# Altium project KeyBoard.PrjPcb
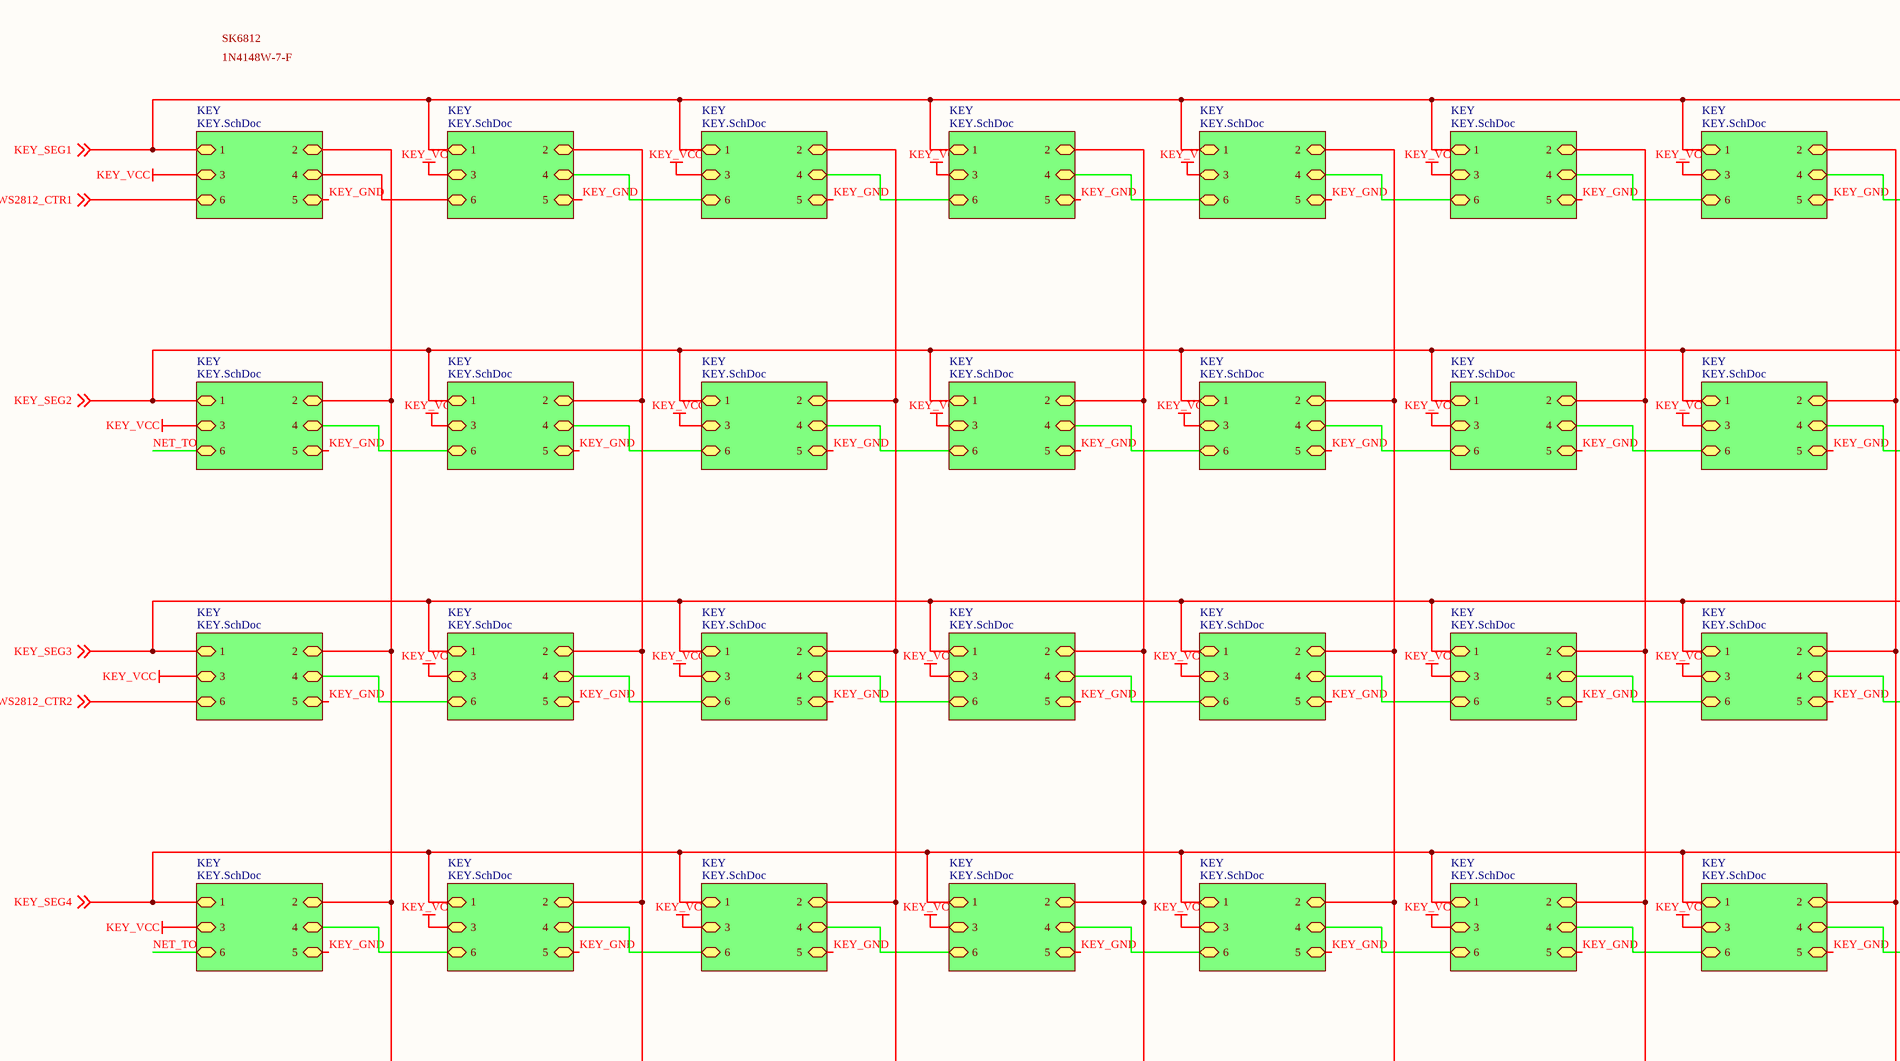
[diagram p0: keyboard.SchDoc, top left]
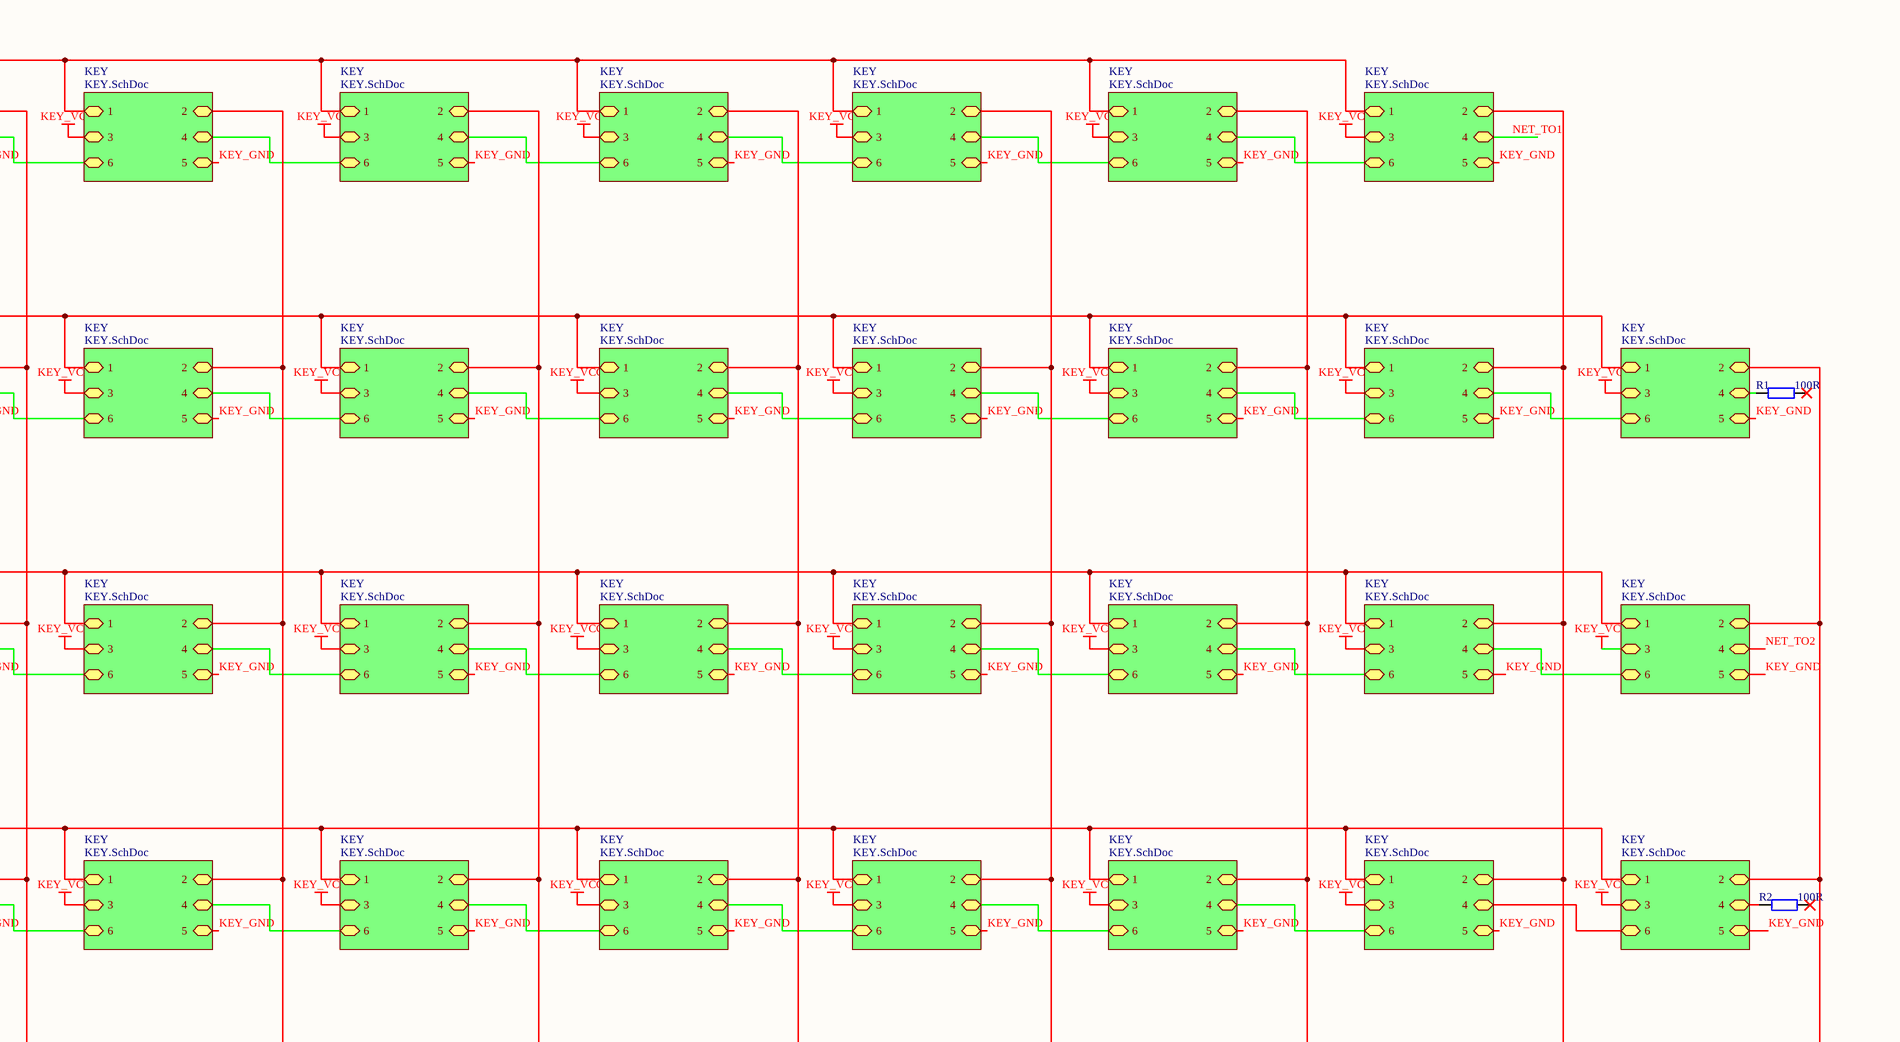
[diagram p1: keyboard.SchDoc, top right]
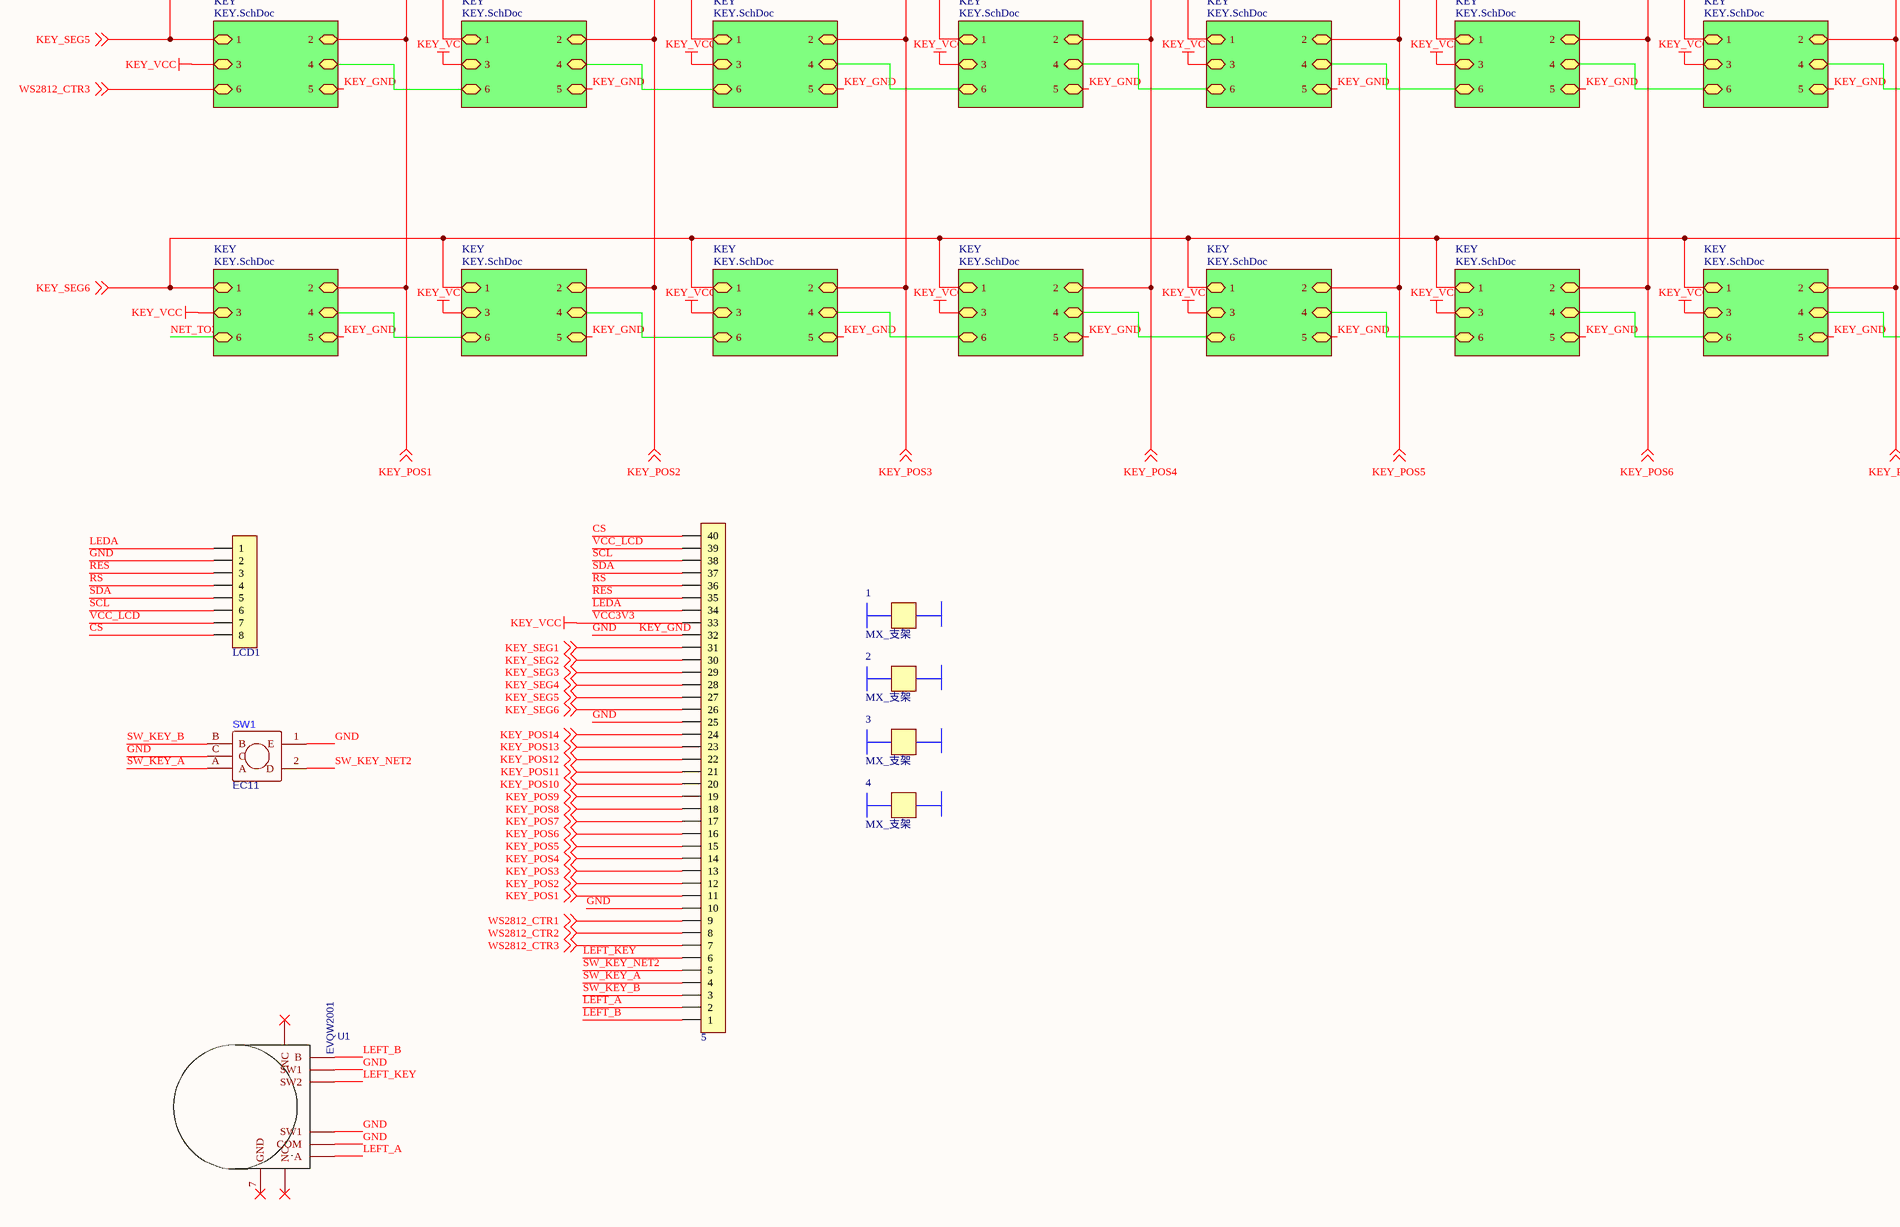
[diagram p2: keyboard.SchDoc, bottom left]
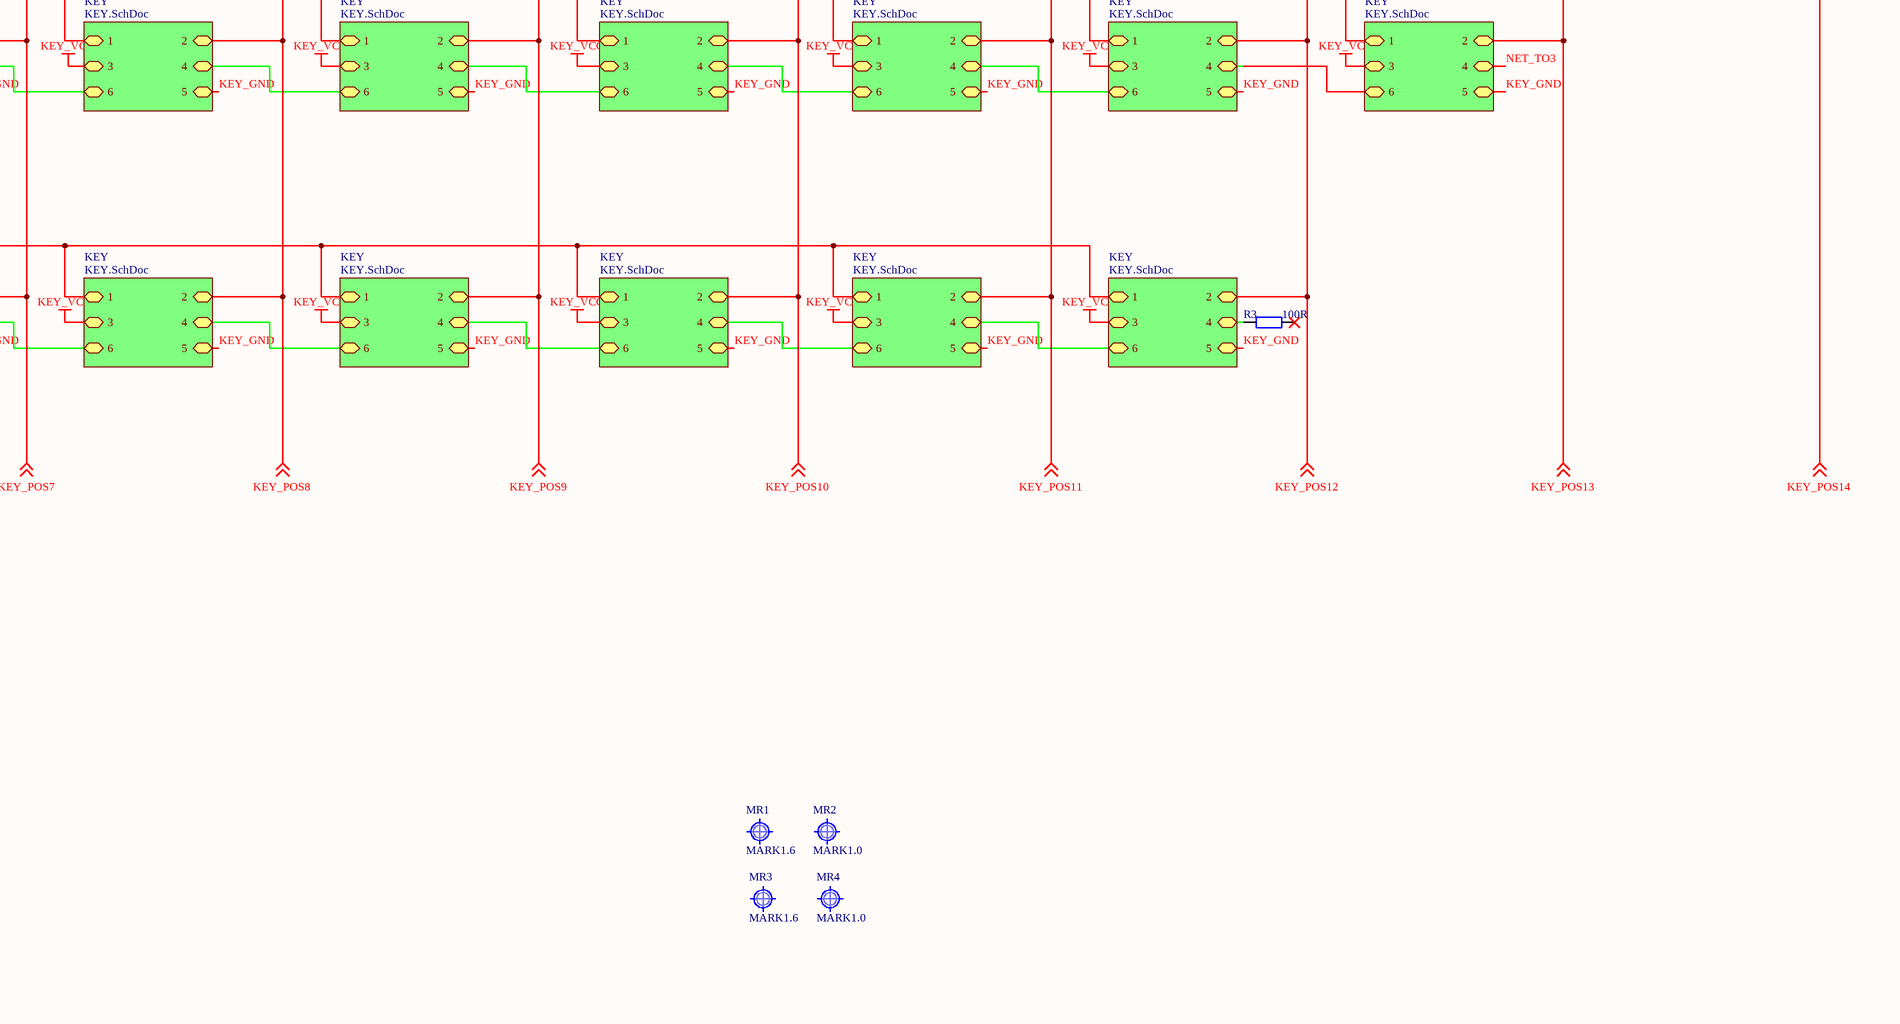
[diagram p3: keyboard.SchDoc, bottom right]
2 sheets, 335 parts. Net scope: hierarchical (ports join the sheet entries above them; power ports are global).
Board file: keyboard.PcbDoc
Sheets:
  keyboard.SchDoc
    KEY = KEY.SchDoc
    KEY = KEY.SchDoc
    KEY = KEY.SchDoc
    KEY = KEY.SchDoc
    KEY = KEY.SchDoc
    KEY = KEY.SchDoc
    KEY = KEY.SchDoc
    KEY = KEY.SchDoc
    KEY = KEY.SchDoc
    KEY = KEY.SchDoc
    KEY = KEY.SchDoc
    KEY = KEY.SchDoc
    KEY = KEY.SchDoc
    KEY = KEY.SchDoc
    KEY = KEY.SchDoc
    KEY = KEY.SchDoc
    KEY = KEY.SchDoc
    KEY = KEY.SchDoc
    KEY = KEY.SchDoc
    KEY = KEY.SchDoc
    KEY = KEY.SchDoc
    KEY = KEY.SchDoc
    KEY = KEY.SchDoc
    KEY = KEY.SchDoc
    KEY = KEY.SchDoc
    KEY = KEY.SchDoc
    KEY = KEY.SchDoc
    KEY = KEY.SchDoc
    KEY = KEY.SchDoc
    KEY = KEY.SchDoc
    KEY = KEY.SchDoc
    KEY = KEY.SchDoc
    KEY = KEY.SchDoc
    KEY = KEY.SchDoc
    KEY = KEY.SchDoc
    KEY = KEY.SchDoc
    KEY = KEY.SchDoc
    KEY = KEY.SchDoc
    KEY = KEY.SchDoc
    KEY = KEY.SchDoc
    KEY = KEY.SchDoc
    KEY = KEY.SchDoc
    KEY = KEY.SchDoc
    KEY = KEY.SchDoc
    KEY = KEY.SchDoc
    KEY = KEY.SchDoc
    KEY = KEY.SchDoc
    KEY = KEY.SchDoc
    KEY = KEY.SchDoc
    KEY = KEY.SchDoc
    KEY = KEY.SchDoc
    KEY = KEY.SchDoc
    KEY = KEY.SchDoc
    KEY = KEY.SchDoc
    KEY = KEY.SchDoc
    KEY = KEY.SchDoc
    KEY = KEY.SchDoc
    KEY = KEY.SchDoc
    KEY = KEY.SchDoc
    KEY = KEY.SchDoc
    KEY = KEY.SchDoc
    KEY = KEY.SchDoc
    KEY = KEY.SchDoc
    KEY = KEY.SchDoc
    KEY = KEY.SchDoc
    KEY = KEY.SchDoc
    KEY = KEY.SchDoc
    KEY = KEY.SchDoc
    KEY = KEY.SchDoc
    KEY = KEY.SchDoc
    KEY = KEY.SchDoc
    KEY = KEY.SchDoc
    KEY = KEY.SchDoc
    KEY = KEY.SchDoc
    KEY = KEY.SchDoc
    KEY = KEY.SchDoc
    KEY = KEY.SchDoc
    KEY = KEY.SchDoc
    KEY = KEY.SchDoc
    KEY = KEY.SchDoc

## Sheet keyboard.SchDoc
size A1

### Parts
1  MX_支架  [1x2]
2  MX_支架  [1x2]
3  MX_支架  [1x2]
4  MX_支架  [1x2]
5  FPC1.0-40P  [FPC0.5 2H-WS-40P]  (value not drawn)
LCD1  FPC1.0-8P  [FPC0.5 2H-WS-8P]  (value not drawn)
MR1  MARK1.6  [Mark 1.6]
MR2  MARK1.0  [Mark 1]
MR3  MARK1.6  [Mark 1.6]
MR4  MARK1.0  [Mark 1]
R1  100R  [R 0805_M]
R2  100R  [R 0805_M]
R3  100R  [R 0805_M]
SW1  EC11  [BOURNS_PEC11R-4XXXF-SXXXX]
U1  EVQW2001  [EVQWK2001 - duplicate]

### Sub-sheets
KEY = KEY.SchDoc: 2 (bidir), 3 (bidir), 5 (bidir), 4 (bidir), 6 (bidir), 1 (bidir)
KEY = KEY.SchDoc: 2 (bidir), 3 (bidir), 5 (bidir), 4 (bidir), 6 (bidir), 1 (bidir)
KEY = KEY.SchDoc: 2 (bidir), 3 (bidir), 5 (bidir), 4 (bidir), 6 (bidir), 1 (bidir)
KEY = KEY.SchDoc: 2 (bidir), 3 (bidir), 5 (bidir), 4 (bidir), 6 (bidir), 1 (bidir)
KEY = KEY.SchDoc: 2 (bidir), 3 (bidir), 5 (bidir), 4 (bidir), 6 (bidir), 1 (bidir)
KEY = KEY.SchDoc: 2 (bidir), 3 (bidir), 5 (bidir), 4 (bidir), 6 (bidir), 1 (bidir)
KEY = KEY.SchDoc: 2 (bidir), 3 (bidir), 5 (bidir), 4 (bidir), 6 (bidir), 1 (bidir)
KEY = KEY.SchDoc: 2 (bidir), 3 (bidir), 5 (bidir), 4 (bidir), 6 (bidir), 1 (bidir)
KEY = KEY.SchDoc: 2 (bidir), 3 (bidir), 5 (bidir), 4 (bidir), 6 (bidir), 1 (bidir)
KEY = KEY.SchDoc: 2 (bidir), 3 (bidir), 5 (bidir), 4 (bidir), 6 (bidir), 1 (bidir)
KEY = KEY.SchDoc: 2 (bidir), 3 (bidir), 5 (bidir), 4 (bidir), 6 (bidir), 1 (bidir)
KEY = KEY.SchDoc: 2 (bidir), 3 (bidir), 5 (bidir), 4 (bidir), 6 (bidir), 1 (bidir)
KEY = KEY.SchDoc: 2 (bidir), 3 (bidir), 5 (bidir), 4 (bidir), 6 (bidir), 1 (bidir)
KEY = KEY.SchDoc: 2 (bidir), 3 (bidir), 5 (bidir), 4 (bidir), 6 (bidir), 1 (bidir)
KEY = KEY.SchDoc: 2 (bidir), 3 (bidir), 5 (bidir), 4 (bidir), 6 (bidir), 1 (bidir)
KEY = KEY.SchDoc: 2 (bidir), 3 (bidir), 5 (bidir), 4 (bidir), 6 (bidir), 1 (bidir)
KEY = KEY.SchDoc: 2 (bidir), 3 (bidir), 5 (bidir), 4 (bidir), 6 (bidir), 1 (bidir)
KEY = KEY.SchDoc: 2 (bidir), 3 (bidir), 5 (bidir), 4 (bidir), 6 (bidir), 1 (bidir)
KEY = KEY.SchDoc: 2 (bidir), 3 (bidir), 5 (bidir), 4 (bidir), 6 (bidir), 1 (bidir)
KEY = KEY.SchDoc: 2 (bidir), 3 (bidir), 5 (bidir), 4 (bidir), 6 (bidir), 1 (bidir)
KEY = KEY.SchDoc: 2 (bidir), 3 (bidir), 5 (bidir), 4 (bidir), 6 (bidir), 1 (bidir)
KEY = KEY.SchDoc: 2 (bidir), 3 (bidir), 5 (bidir), 4 (bidir), 6 (bidir), 1 (bidir)
KEY = KEY.SchDoc: 2 (bidir), 3 (bidir), 5 (bidir), 4 (bidir), 6 (bidir), 1 (bidir)
KEY = KEY.SchDoc: 2 (bidir), 3 (bidir), 5 (bidir), 4 (bidir), 6 (bidir), 1 (bidir)
KEY = KEY.SchDoc: 2 (bidir), 3 (bidir), 5 (bidir), 4 (bidir), 6 (bidir), 1 (bidir)
KEY = KEY.SchDoc: 2 (bidir), 3 (bidir), 5 (bidir), 4 (bidir), 6 (bidir), 1 (bidir)
KEY = KEY.SchDoc: 2 (bidir), 3 (bidir), 5 (bidir), 4 (bidir), 6 (bidir), 1 (bidir)
KEY = KEY.SchDoc: 2 (bidir), 3 (bidir), 5 (bidir), 4 (bidir), 6 (bidir), 1 (bidir)
KEY = KEY.SchDoc: 2 (bidir), 3 (bidir), 5 (bidir), 4 (bidir), 6 (bidir), 1 (bidir)
KEY = KEY.SchDoc: 2 (bidir), 3 (bidir), 5 (bidir), 4 (bidir), 6 (bidir), 1 (bidir)
KEY = KEY.SchDoc: 2 (bidir), 3 (bidir), 5 (bidir), 4 (bidir), 6 (bidir), 1 (bidir)
KEY = KEY.SchDoc: 2 (bidir), 3 (bidir), 5 (bidir), 4 (bidir), 6 (bidir), 1 (bidir)
KEY = KEY.SchDoc: 2 (bidir), 3 (bidir), 5 (bidir), 4 (bidir), 6 (bidir), 1 (bidir)
KEY = KEY.SchDoc: 2 (bidir), 3 (bidir), 5 (bidir), 4 (bidir), 6 (bidir), 1 (bidir)
KEY = KEY.SchDoc: 2 (bidir), 3 (bidir), 5 (bidir), 4 (bidir), 6 (bidir), 1 (bidir)
KEY = KEY.SchDoc: 2 (bidir), 3 (bidir), 5 (bidir), 4 (bidir), 6 (bidir), 1 (bidir)
KEY = KEY.SchDoc: 2 (bidir), 3 (bidir), 5 (bidir), 4 (bidir), 6 (bidir), 1 (bidir)
KEY = KEY.SchDoc: 2 (bidir), 3 (bidir), 5 (bidir), 4 (bidir), 6 (bidir), 1 (bidir)
KEY = KEY.SchDoc: 2 (bidir), 3 (bidir), 5 (bidir), 4 (bidir), 6 (bidir), 1 (bidir)
KEY = KEY.SchDoc: 2 (bidir), 3 (bidir), 5 (bidir), 4 (bidir), 6 (bidir), 1 (bidir)
KEY = KEY.SchDoc: 2 (bidir), 3 (bidir), 5 (bidir), 4 (bidir), 6 (bidir), 1 (bidir)
KEY = KEY.SchDoc: 2 (bidir), 3 (bidir), 5 (bidir), 4 (bidir), 6 (bidir), 1 (bidir)
KEY = KEY.SchDoc: 2 (bidir), 3 (bidir), 5 (bidir), 4 (bidir), 6 (bidir), 1 (bidir)
KEY = KEY.SchDoc: 2 (bidir), 3 (bidir), 5 (bidir), 4 (bidir), 6 (bidir), 1 (bidir)
KEY = KEY.SchDoc: 2 (bidir), 3 (bidir), 5 (bidir), 4 (bidir), 6 (bidir), 1 (bidir)
KEY = KEY.SchDoc: 2 (bidir), 3 (bidir), 5 (bidir), 4 (bidir), 6 (bidir), 1 (bidir)
KEY = KEY.SchDoc: 2 (bidir), 3 (bidir), 5 (bidir), 4 (bidir), 6 (bidir), 1 (bidir)
KEY = KEY.SchDoc: 2 (bidir), 3 (bidir), 5 (bidir), 4 (bidir), 6 (bidir), 1 (bidir)
KEY = KEY.SchDoc: 2 (bidir), 3 (bidir), 5 (bidir), 4 (bidir), 6 (bidir), 1 (bidir)
KEY = KEY.SchDoc: 2 (bidir), 3 (bidir), 5 (bidir), 4 (bidir), 6 (bidir), 1 (bidir)
KEY = KEY.SchDoc: 2 (bidir), 3 (bidir), 5 (bidir), 4 (bidir), 6 (bidir), 1 (bidir)
KEY = KEY.SchDoc: 2 (bidir), 3 (bidir), 5 (bidir), 4 (bidir), 6 (bidir), 1 (bidir)
KEY = KEY.SchDoc: 2 (bidir), 3 (bidir), 5 (bidir), 4 (bidir), 6 (bidir), 1 (bidir)
KEY = KEY.SchDoc: 2 (bidir), 3 (bidir), 5 (bidir), 4 (bidir), 6 (bidir), 1 (bidir)
KEY = KEY.SchDoc: 2 (bidir), 3 (bidir), 5 (bidir), 4 (bidir), 6 (bidir), 1 (bidir)
KEY = KEY.SchDoc: 2 (bidir), 3 (bidir), 5 (bidir), 4 (bidir), 6 (bidir), 1 (bidir)
KEY = KEY.SchDoc: 2 (bidir), 3 (bidir), 5 (bidir), 4 (bidir), 6 (bidir), 1 (bidir)
KEY = KEY.SchDoc: 2 (bidir), 3 (bidir), 5 (bidir), 4 (bidir), 6 (bidir), 1 (bidir)
KEY = KEY.SchDoc: 2 (bidir), 3 (bidir), 5 (bidir), 4 (bidir), 6 (bidir), 1 (bidir)
KEY = KEY.SchDoc: 2 (bidir), 3 (bidir), 5 (bidir), 4 (bidir), 6 (bidir), 1 (bidir)
KEY = KEY.SchDoc: 2 (bidir), 3 (bidir), 5 (bidir), 4 (bidir), 6 (bidir), 1 (bidir)
KEY = KEY.SchDoc: 2 (bidir), 3 (bidir), 5 (bidir), 4 (bidir), 6 (bidir), 1 (bidir)
KEY = KEY.SchDoc: 2 (bidir), 3 (bidir), 5 (bidir), 4 (bidir), 6 (bidir), 1 (bidir)
KEY = KEY.SchDoc: 2 (bidir), 3 (bidir), 5 (bidir), 4 (bidir), 6 (bidir), 1 (bidir)
KEY = KEY.SchDoc: 2 (bidir), 3 (bidir), 5 (bidir), 4 (bidir), 6 (bidir), 1 (bidir)
KEY = KEY.SchDoc: 2 (bidir), 3 (bidir), 5 (bidir), 4 (bidir), 6 (bidir), 1 (bidir)
KEY = KEY.SchDoc: 2 (bidir), 3 (bidir), 5 (bidir), 4 (bidir), 6 (bidir), 1 (bidir)
KEY = KEY.SchDoc: 2 (bidir), 3 (bidir), 5 (bidir), 4 (bidir), 6 (bidir), 1 (bidir)
KEY = KEY.SchDoc: 2 (bidir), 3 (bidir), 5 (bidir), 4 (bidir), 6 (bidir), 1 (bidir)
KEY = KEY.SchDoc: 2 (bidir), 3 (bidir), 5 (bidir), 4 (bidir), 6 (bidir), 1 (bidir)
KEY = KEY.SchDoc: 2 (bidir), 3 (bidir), 5 (bidir), 4 (bidir), 6 (bidir), 1 (bidir)
KEY = KEY.SchDoc: 2 (bidir), 3 (bidir), 5 (bidir), 4 (bidir), 6 (bidir), 1 (bidir)
KEY = KEY.SchDoc: 2 (bidir), 3 (bidir), 5 (bidir), 4 (bidir), 6 (bidir), 1 (bidir)
KEY = KEY.SchDoc: 2 (bidir), 3 (bidir), 5 (bidir), 4 (bidir), 6 (bidir), 1 (bidir)
KEY = KEY.SchDoc: 2 (bidir), 3 (bidir), 5 (bidir), 4 (bidir), 6 (bidir), 1 (bidir)
KEY = KEY.SchDoc: 2 (bidir), 3 (bidir), 5 (bidir), 4 (bidir), 6 (bidir), 1 (bidir)
KEY = KEY.SchDoc: 2 (bidir), 3 (bidir), 5 (bidir), 4 (bidir), 6 (bidir), 1 (bidir)
KEY = KEY.SchDoc: 2 (bidir), 3 (bidir), 5 (bidir), 4 (bidir), 6 (bidir), 1 (bidir)
KEY = KEY.SchDoc: 2 (bidir), 3 (bidir), 5 (bidir), 4 (bidir), 6 (bidir), 1 (bidir)
KEY = KEY.SchDoc: 2 (bidir), 3 (bidir), 5 (bidir), 4 (bidir), 6 (bidir), 1 (bidir)

### Nets
VCC3V3: 5.33 ; sheet KEY/3, sheet KEY/3, sheet KEY/3, sheet KEY/3, sheet KEY/3, sheet KEY/3, sheet KEY/3, sheet KEY/3, sheet KEY/3, sheet KEY/3, sheet KEY/3, sheet KEY/3, sheet KEY/3, sheet KEY/3, sheet KEY/3, sheet KEY/3, sheet KEY/3, sheet KEY/3, sheet KEY/3, sheet KEY/3, sheet KEY/3, sheet KEY/3, sheet KEY/3, sheet KEY/3, sheet KEY/3, sheet KEY/3, sheet KEY/3, sheet KEY/3, sheet KEY/3, sheet KEY/3, sheet KEY/3, sheet KEY/3, sheet KEY/3, sheet KEY/3, sheet KEY/3, sheet KEY/3, sheet KEY/3, sheet KEY/3, sheet KEY/3, sheet KEY/3, sheet KEY/3, sheet KEY/3, sheet KEY/3, sheet KEY/3, sheet KEY/3, sheet KEY/3, sheet KEY/3, sheet KEY/3, sheet KEY/3, sheet KEY/3, sheet KEY/3, sheet KEY/3, sheet KEY/3, sheet KEY/3, sheet KEY/3, sheet KEY/3, sheet KEY/3, sheet KEY/3, sheet KEY/3, sheet KEY/3, sheet KEY/3, sheet KEY/3, sheet KEY/3, sheet KEY/3, sheet KEY/3, sheet KEY/3, sheet KEY/3, sheet KEY/3, sheet KEY/3, sheet KEY/3, sheet KEY/3, sheet KEY/3, sheet KEY/3, sheet KEY/3, sheet KEY/3, sheet KEY/3, sheet KEY/3, sheet KEY/3, sheet KEY/3, sheet KEY/3  [also labelled KEY_VCC]
CS: 5.40 LCD1.8
GND: 5.10 5.25 5.32 LCD1.2 SW1.1(E) SW1.C U1.2(SW1) U1.4(SW1) U1.5(COM) ; sheet KEY/5, sheet KEY/5, sheet KEY/5, sheet KEY/5, sheet KEY/5, sheet KEY/5, sheet KEY/5, sheet KEY/5, sheet KEY/5, sheet KEY/5, sheet KEY/5, sheet KEY/5, sheet KEY/5, sheet KEY/5, sheet KEY/5, sheet KEY/5, sheet KEY/5, sheet KEY/5, sheet KEY/5, sheet KEY/5, sheet KEY/5, sheet KEY/5, sheet KEY/5, sheet KEY/5, sheet KEY/5, sheet KEY/5, sheet KEY/5, sheet KEY/5, sheet KEY/5, sheet KEY/5, sheet KEY/5, sheet KEY/5, sheet KEY/5, sheet KEY/5, sheet KEY/5, sheet KEY/5, sheet KEY/5, sheet KEY/5, sheet KEY/5, sheet KEY/5, sheet KEY/5, sheet KEY/5, sheet KEY/5, sheet KEY/5, sheet KEY/5, sheet KEY/5, sheet KEY/5, sheet KEY/5, sheet KEY/5, sheet KEY/5, sheet KEY/5, sheet KEY/5, sheet KEY/5, sheet KEY/5, sheet KEY/5, sheet KEY/5, sheet KEY/5, sheet KEY/5, sheet KEY/5, sheet KEY/5, sheet KEY/5, sheet KEY/5, sheet KEY/5, sheet KEY/5, sheet KEY/5, sheet KEY/5, sheet KEY/5, sheet KEY/5, sheet KEY/5, sheet KEY/5, sheet KEY/5, sheet KEY/5, sheet KEY/5, sheet KEY/5, sheet KEY/5, sheet KEY/5, sheet KEY/5, sheet KEY/5, sheet KEY/5, sheet KEY/5  [also labelled KEY_GND]
KEY_POS1: 5.11 ; off-sheet KEY_POS1, sheet KEY/2, sheet KEY/2, sheet KEY/2, sheet KEY/2, sheet KEY/2, sheet KEY/2
KEY_POS2: 5.12 ; off-sheet KEY_POS2, sheet KEY/2, sheet KEY/2, sheet KEY/2, sheet KEY/2, sheet KEY/2, sheet KEY/2
KEY_POS3: 5.13 ; off-sheet KEY_POS3, sheet KEY/2, sheet KEY/2, sheet KEY/2, sheet KEY/2, sheet KEY/2, sheet KEY/2
KEY_POS4: 5.14 ; off-sheet KEY_POS4, sheet KEY/2, sheet KEY/2, sheet KEY/2, sheet KEY/2, sheet KEY/2, sheet KEY/2
KEY_POS5: 5.15 ; off-sheet KEY_POS5, sheet KEY/2, sheet KEY/2, sheet KEY/2, sheet KEY/2, sheet KEY/2, sheet KEY/2
KEY_POS6: 5.16 ; off-sheet KEY_POS6, sheet KEY/2, sheet KEY/2, sheet KEY/2, sheet KEY/2, sheet KEY/2, sheet KEY/2
KEY_POS7: 5.17 ; off-sheet KEY_POS7, sheet KEY/2, sheet KEY/2, sheet KEY/2, sheet KEY/2, sheet KEY/2, sheet KEY/2
KEY_POS8: 5.18 ; off-sheet KEY_POS8, sheet KEY/2, sheet KEY/2, sheet KEY/2, sheet KEY/2, sheet KEY/2, sheet KEY/2
KEY_POS9: 5.19 ; off-sheet KEY_POS9, sheet KEY/2, sheet KEY/2, sheet KEY/2, sheet KEY/2, sheet KEY/2, sheet KEY/2
KEY_POS10: 5.20 ; off-sheet KEY_POS10, sheet KEY/2, sheet KEY/2, sheet KEY/2, sheet KEY/2, sheet KEY/2, sheet KEY/2
KEY_POS11: 5.21 ; off-sheet KEY_POS11, sheet KEY/2, sheet KEY/2, sheet KEY/2, sheet KEY/2, sheet KEY/2, sheet KEY/2
KEY_POS12: 5.22 ; off-sheet KEY_POS12, sheet KEY/2, sheet KEY/2, sheet KEY/2, sheet KEY/2, sheet KEY/2, sheet KEY/2
KEY_POS13: 5.23 ; off-sheet KEY_POS13, sheet KEY/2, sheet KEY/2, sheet KEY/2, sheet KEY/2, sheet KEY/2
KEY_POS14: 5.24 ; off-sheet KEY_POS14, sheet KEY/2, sheet KEY/2, sheet KEY/2
KEY_SEG1: 5.31 ; off-sheet KEY_SEG1, sheet KEY/1, sheet KEY/1, sheet KEY/1, sheet KEY/1, sheet KEY/1, sheet KEY/1, sheet KEY/1, sheet KEY/1, sheet KEY/1, sheet KEY/1, sheet KEY/1, sheet KEY/1, sheet KEY/1
KEY_SEG2: 5.30 ; off-sheet KEY_SEG2, sheet KEY/1, sheet KEY/1, sheet KEY/1, sheet KEY/1, sheet KEY/1, sheet KEY/1, sheet KEY/1, sheet KEY/1, sheet KEY/1, sheet KEY/1, sheet KEY/1, sheet KEY/1, sheet KEY/1, sheet KEY/1
KEY_SEG3: 5.29 ; off-sheet KEY_SEG3, sheet KEY/1, sheet KEY/1, sheet KEY/1, sheet KEY/1, sheet KEY/1, sheet KEY/1, sheet KEY/1, sheet KEY/1, sheet KEY/1, sheet KEY/1, sheet KEY/1, sheet KEY/1, sheet KEY/1, sheet KEY/1
KEY_SEG4: 5.28 ; off-sheet KEY_SEG4, sheet KEY/1, sheet KEY/1, sheet KEY/1, sheet KEY/1, sheet KEY/1, sheet KEY/1, sheet KEY/1, sheet KEY/1, sheet KEY/1, sheet KEY/1, sheet KEY/1, sheet KEY/1, sheet KEY/1, sheet KEY/1
KEY_SEG5: 5.27 ; off-sheet KEY_SEG5, sheet KEY/1, sheet KEY/1, sheet KEY/1, sheet KEY/1, sheet KEY/1, sheet KEY/1, sheet KEY/1, sheet KEY/1, sheet KEY/1, sheet KEY/1, sheet KEY/1, sheet KEY/1, sheet KEY/1
KEY_SEG6: 5.26 ; off-sheet KEY_SEG6, sheet KEY/1, sheet KEY/1, sheet KEY/1, sheet KEY/1, sheet KEY/1, sheet KEY/1, sheet KEY/1, sheet KEY/1, sheet KEY/1, sheet KEY/1, sheet KEY/1, sheet KEY/1
LEDA: 5.34 LCD1.1
LEFT_A: 5.2 U1.6(A)
LEFT_B: 5.1 U1.1(B)
LEFT_KEY: 5.6 U1.3(SW2)
NET_TO1: sheet KEY/4, sheet KEY/6
NET_TO2: sheet KEY/4, sheet KEY/6
NET_TO3: sheet KEY/4, sheet KEY/6
RES: 5.35 LCD1.3
RS: 5.36 LCD1.4
SCL: 5.38 LCD1.6
SDA: 5.37 LCD1.5
SW_KEY_A: 5.4 SW1.A
SW_KEY_B: 5.3 SW1.B
SW_KEY_NET2: 5.5 SW1.2(D)
VCC_LCD: 5.39 LCD1.7
WS2812_CTR1: 5.9 ; off-sheet WS2812_CTR1, sheet KEY/6
WS2812_CTR2: 5.8 ; off-sheet WS2812_CTR2, sheet KEY/6
WS2812_CTR3: 5.7 ; off-sheet WS2812_CTR3, sheet KEY/6
NetR1_1: R1.1 ; sheet KEY/4
NetR2_1: R2.1 ; sheet KEY/4
NetR3_1: R3.1 ; sheet KEY/4
NetRGB1_KEY#1_4: sheet KEY/4, sheet KEY/6
NetRGB1_KEY#1_6: sheet KEY/6, sheet KEY/4
NetRGB1_KEY#2_4: sheet KEY/4, sheet KEY/6
NetRGB1_KEY#4_4: sheet KEY/4, sheet KEY/6
NetRGB1_KEY#5_4: sheet KEY/4, sheet KEY/6
NetRGB1_KEY#6_4: sheet KEY/4, sheet KEY/6
NetRGB1_KEY#7_4: sheet KEY/4, sheet KEY/6
NetRGB1_KEY#8_4: sheet KEY/4, sheet KEY/6
NetRGB1_KEY#9_4: sheet KEY/4, sheet KEY/6
NetRGB1_KEY#10_4: sheet KEY/4, sheet KEY/6
NetRGB1_KEY#11_4: sheet KEY/4, sheet KEY/6
NetRGB1_KEY#12_4: sheet KEY/4, sheet KEY/6
NetRGB1_KEY#14_4: sheet KEY/4, sheet KEY/6
NetRGB1_KEY#15_4: sheet KEY/4, sheet KEY/6
NetRGB1_KEY#16_4: sheet KEY/4, sheet KEY/6
NetRGB1_KEY#17_4: sheet KEY/4, sheet KEY/6
NetRGB1_KEY#18_4: sheet KEY/4, sheet KEY/6
NetRGB1_KEY#19_4: sheet KEY/4, sheet KEY/6
NetRGB1_KEY#20_4: sheet KEY/4, sheet KEY/6
NetRGB1_KEY#21_4: sheet KEY/4, sheet KEY/6
NetRGB1_KEY#22_4: sheet KEY/4, sheet KEY/6
NetRGB1_KEY#23_4: sheet KEY/4, sheet KEY/6
NetRGB1_KEY#24_4: sheet KEY/4, sheet KEY/6
NetRGB1_KEY#25_4: sheet KEY/4, sheet KEY/6
NetRGB1_KEY#26_4: sheet KEY/4, sheet KEY/6
NetRGB1_KEY#28_4: sheet KEY/4, sheet KEY/6
NetRGB1_KEY#29_4: sheet KEY/4, sheet KEY/6
NetRGB1_KEY#30_4: sheet KEY/4, sheet KEY/6
NetRGB1_KEY#31_4: sheet KEY/4, sheet KEY/6
NetRGB1_KEY#32_4: sheet KEY/4, sheet KEY/6
NetRGB1_KEY#33_4: sheet KEY/4, sheet KEY/6
NetRGB1_KEY#34_4: sheet KEY/4, sheet KEY/6
NetRGB1_KEY#35_4: sheet KEY/4, sheet KEY/6
NetRGB1_KEY#36_4: sheet KEY/4, sheet KEY/6
NetRGB1_KEY#37_4: sheet KEY/4, sheet KEY/6
NetRGB1_KEY#38_4: sheet KEY/4, sheet KEY/6
NetRGB1_KEY#39_4: sheet KEY/4, sheet KEY/6
NetRGB1_KEY#40_4: sheet KEY/4, sheet KEY/6
NetRGB1_KEY#42_4: sheet KEY/4, sheet KEY/6
NetRGB1_KEY#43_4: sheet KEY/4, sheet KEY/6
NetRGB1_KEY#44_4: sheet KEY/4, sheet KEY/6
NetRGB1_KEY#45_4: sheet KEY/4, sheet KEY/6
NetRGB1_KEY#46_4: sheet KEY/4, sheet KEY/6
NetRGB1_KEY#47_4: sheet KEY/4, sheet KEY/6
NetRGB1_KEY#48_4: sheet KEY/4, sheet KEY/6
NetRGB1_KEY#49_4: sheet KEY/4, sheet KEY/6
NetRGB1_KEY#50_4: sheet KEY/4, sheet KEY/6
NetRGB1_KEY#51_4: sheet KEY/4, sheet KEY/6
NetRGB1_KEY#52_4: sheet KEY/4, sheet KEY/6
NetRGB1_KEY#53_4: sheet KEY/4, sheet KEY/6
NetRGB1_KEY#54_4: sheet KEY/4, sheet KEY/6
NetRGB1_KEY#56_4: sheet KEY/4, sheet KEY/6
NetRGB1_KEY#57_4: sheet KEY/4, sheet KEY/6
NetRGB1_KEY#58_4: sheet KEY/4, sheet KEY/6
NetRGB1_KEY#59_4: sheet KEY/4, sheet KEY/6
NetRGB1_KEY#60_4: sheet KEY/4, sheet KEY/6
NetRGB1_KEY#61_4: sheet KEY/4, sheet KEY/6
NetRGB1_KEY#62_4: sheet KEY/4, sheet KEY/6
NetRGB1_KEY#63_4: sheet KEY/4, sheet KEY/6
NetRGB1_KEY#64_4: sheet KEY/4, sheet KEY/6
NetRGB1_KEY#65_4: sheet KEY/4, sheet KEY/6
NetRGB1_KEY#66_4: sheet KEY/4, sheet KEY/6
NetRGB1_KEY#67_4: sheet KEY/4, sheet KEY/6
NetRGB1_KEY#69_4: sheet KEY/4, sheet KEY/6
NetRGB1_KEY#70_4: sheet KEY/4, sheet KEY/6
NetRGB1_KEY#71_4: sheet KEY/4, sheet KEY/6
NetRGB1_KEY#72_4: sheet KEY/4, sheet KEY/6
NetRGB1_KEY#73_4: sheet KEY/4, sheet KEY/6
NetRGB1_KEY#74_4: sheet KEY/4, sheet KEY/6
NetRGB1_KEY#75_4: sheet KEY/4, sheet KEY/6
NetRGB1_KEY#76_4: sheet KEY/4, sheet KEY/6
NetRGB1_KEY#77_4: sheet KEY/4, sheet KEY/6
NetRGB1_KEY#78_4: sheet KEY/4, sheet KEY/6
NetRGB1_KEY#79_4: sheet KEY/4, sheet KEY/6

Not connected (* = marked no-connect by the designer): R1 2*; R2 2*; R3 2*; U1 7(GND)* 8(NC)*

### Notes on the sheet
- SK6812
- 1N4148W-7-F
- Title
- Size:
- Date:
- File:
- A1
- Number:
- Time:
- Revision:
- Sheet
- of

### Library data of the parts
5 = FPC-40P: FPC连接器; 版权归属: 黎明电子style; BOM名称: FPC连接器; 学习资源: https://lmdzstyle.taobao.com/
LCD1 = FPC-8P: FPC连接器; 版权归属: 黎明电子style; BOM名称: FPC连接器; 学习资源: https://lmdzstyle.taobao.com/
MR1-MR4 = MARK: 光学定位点
R1-R3 = R: 贴片电阻
U1 = EVQW2001: Contributor: jam_dan; spicePre: U; spiceSymbolName: EVQW2001

## Sheet KEY.SchDoc
size A4
Used 80 times, as channels KEY, KEY, KEY, KEY, KEY, KEY, KEY, KEY, KEY, KEY, KEY, KEY, KEY, KEY, KEY, KEY, KEY, KEY, KEY, KEY, KEY, KEY, KEY, KEY, KEY, KEY, KEY, KEY, KEY, KEY, KEY, KEY, KEY, KEY, KEY, KEY, KEY, KEY, KEY, KEY, KEY, KEY, KEY, KEY, KEY, KEY, KEY, KEY, KEY, KEY, KEY, KEY, KEY, KEY, KEY, KEY, KEY, KEY, KEY, KEY, KEY, KEY, KEY, KEY, KEY, KEY, KEY, KEY, KEY, KEY, KEY, KEY, KEY, KEY, KEY, KEY, KEY, KEY, KEY, KEY. Parts and nets are listed once, with the designators drawn on the sheet.
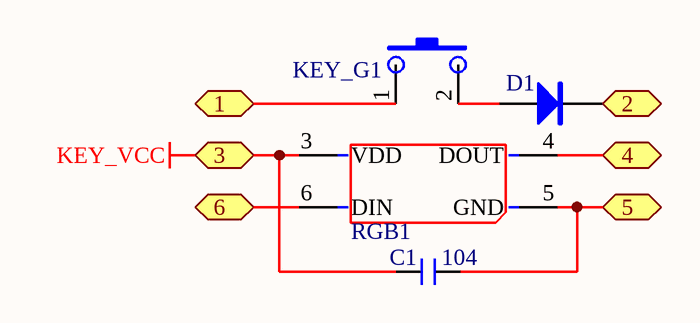
[diagram p4: KEY.SchDoc]

### Parts
C1  104  [0805]
D1  1N4148W-7-F  [SOD-123]  (value not drawn)
KEY_G1  KEY_G  [GATERON]  (value not drawn)
RGB1  RGB  [WS2812]  (value not drawn)

### Ports
1 (bidir), 2 (bidir), 3 (bidir), 4 (bidir), 5 (bidir), 6 (bidir)

### Nets
KEY_VCC: C1.1 RGB1.3(VDD) ; port 3
1: KEY_G1.1 ; port 1
2: D1.2(K) ; port 2
4: RGB1.4(DOUT) ; port 4
5: C1.2 RGB1.5(GND) ; port 5
6: RGB1.6(DIN) ; port 6
NetD1_1: D1.1(A) KEY_G1.2

### Channels
KEY: designators end in _KEY#1; ports 1=KEY_SEG1 2=KEY_POS2 3=VCC3V3 4=NetRGB1_KEY#1_4 5=GND 6=NetRGB1_KEY#1_6
KEY: designators end in _KEY#2; ports 1=KEY_SEG1 2=KEY_POS3 3=VCC3V3 4=NetRGB1_KEY#2_4 5=GND 6=NetRGB1_KEY#1_4
KEY: designators end in _KEY#3; ports 1=KEY_SEG1 2=KEY_POS1 3=VCC3V3 4=NetRGB1_KEY#1_6 5=GND 6=WS2812_CTR1
KEY: designators end in _KEY#4; ports 1=KEY_SEG1 2=KEY_POS4 3=VCC3V3 4=NetRGB1_KEY#4_4 5=GND 6=NetRGB1_KEY#2_4
KEY: designators end in _KEY#5; ports 1=KEY_SEG1 2=KEY_POS5 3=VCC3V3 4=NetRGB1_KEY#5_4 5=GND 6=NetRGB1_KEY#4_4
KEY: designators end in _KEY#6; ports 1=KEY_SEG1 2=KEY_POS6 3=VCC3V3 4=NetRGB1_KEY#6_4 5=GND 6=NetRGB1_KEY#5_4
KEY: designators end in _KEY#7; ports 1=KEY_SEG1 2=KEY_POS7 3=VCC3V3 4=NetRGB1_KEY#7_4 5=GND 6=NetRGB1_KEY#6_4
KEY: designators end in _KEY#8; ports 1=KEY_SEG1 2=KEY_POS8 3=VCC3V3 4=NetRGB1_KEY#8_4 5=GND 6=NetRGB1_KEY#7_4
KEY: designators end in _KEY#9; ports 1=KEY_SEG1 2=KEY_POS9 3=VCC3V3 4=NetRGB1_KEY#9_4 5=GND 6=NetRGB1_KEY#8_4
KEY: designators end in _KEY#10; ports 1=KEY_SEG1 2=KEY_POS10 3=VCC3V3 4=NetRGB1_KEY#10_4 5=GND 6=NetRGB1_KEY#9_4
KEY: designators end in _KEY#11; ports 1=KEY_SEG1 2=KEY_POS11 3=VCC3V3 4=NetRGB1_KEY#11_4 5=GND 6=NetRGB1_KEY#10_4
KEY: designators end in _KEY#12; ports 1=KEY_SEG1 2=KEY_POS12 3=VCC3V3 4=NetRGB1_KEY#12_4 5=GND 6=NetRGB1_KEY#11_4
KEY: designators end in _KEY#13; ports 1=KEY_SEG1 2=KEY_POS13 3=VCC3V3 4=NET_TO1 5=GND 6=NetRGB1_KEY#12_4
KEY: designators end in _KEY#14; ports 1=KEY_SEG2 2=KEY_POS1 3=VCC3V3 4=NetRGB1_KEY#14_4 5=GND 6=NET_TO1
KEY: designators end in _KEY#15; ports 1=KEY_SEG2 2=KEY_POS2 3=VCC3V3 4=NetRGB1_KEY#15_4 5=GND 6=NetRGB1_KEY#14_4
KEY: designators end in _KEY#16; ports 1=KEY_SEG2 2=KEY_POS3 3=VCC3V3 4=NetRGB1_KEY#16_4 5=GND 6=NetRGB1_KEY#15_4
KEY: designators end in _KEY#17; ports 1=KEY_SEG2 2=KEY_POS4 3=VCC3V3 4=NetRGB1_KEY#17_4 5=GND 6=NetRGB1_KEY#16_4
KEY: designators end in _KEY#18; ports 1=KEY_SEG2 2=KEY_POS5 3=VCC3V3 4=NetRGB1_KEY#18_4 5=GND 6=NetRGB1_KEY#17_4
KEY: designators end in _KEY#19; ports 1=KEY_SEG2 2=KEY_POS6 3=VCC3V3 4=NetRGB1_KEY#19_4 5=GND 6=NetRGB1_KEY#18_4
KEY: designators end in _KEY#20; ports 1=KEY_SEG2 2=KEY_POS7 3=VCC3V3 4=NetRGB1_KEY#20_4 5=GND 6=NetRGB1_KEY#19_4
KEY: designators end in _KEY#21; ports 1=KEY_SEG2 2=KEY_POS8 3=VCC3V3 4=NetRGB1_KEY#21_4 5=GND 6=NetRGB1_KEY#20_4
KEY: designators end in _KEY#22; ports 1=KEY_SEG2 2=KEY_POS9 3=VCC3V3 4=NetRGB1_KEY#22_4 5=GND 6=NetRGB1_KEY#21_4
KEY: designators end in _KEY#23; ports 1=KEY_SEG2 2=KEY_POS10 3=VCC3V3 4=NetRGB1_KEY#23_4 5=GND 6=NetRGB1_KEY#22_4
KEY: designators end in _KEY#24; ports 1=KEY_SEG2 2=KEY_POS11 3=VCC3V3 4=NetRGB1_KEY#24_4 5=GND 6=NetRGB1_KEY#23_4
KEY: designators end in _KEY#25; ports 1=KEY_SEG2 2=KEY_POS12 3=VCC3V3 4=NetRGB1_KEY#25_4 5=GND 6=NetRGB1_KEY#24_4
KEY: designators end in _KEY#26; ports 1=KEY_SEG2 2=KEY_POS13 3=VCC3V3 4=NetRGB1_KEY#26_4 5=GND 6=NetRGB1_KEY#25_4
KEY: designators end in _KEY#27; ports 1=KEY_SEG2 2=KEY_POS14 3=VCC3V3 4=NetR1_1 5=GND 6=NetRGB1_KEY#26_4
KEY: designators end in _KEY#28; ports 1=KEY_SEG3 2=KEY_POS1 3=VCC3V3 4=NetRGB1_KEY#28_4 5=GND 6=WS2812_CTR2
KEY: designators end in _KEY#29; ports 1=KEY_SEG3 2=KEY_POS2 3=VCC3V3 4=NetRGB1_KEY#29_4 5=GND 6=NetRGB1_KEY#28_4
KEY: designators end in _KEY#30; ports 1=KEY_SEG3 2=KEY_POS3 3=VCC3V3 4=NetRGB1_KEY#30_4 5=GND 6=NetRGB1_KEY#29_4
KEY: designators end in _KEY#31; ports 1=KEY_SEG3 2=KEY_POS4 3=VCC3V3 4=NetRGB1_KEY#31_4 5=GND 6=NetRGB1_KEY#30_4
KEY: designators end in _KEY#32; ports 1=KEY_SEG3 2=KEY_POS5 3=VCC3V3 4=NetRGB1_KEY#32_4 5=GND 6=NetRGB1_KEY#31_4
KEY: designators end in _KEY#33; ports 1=KEY_SEG3 2=KEY_POS6 3=VCC3V3 4=NetRGB1_KEY#33_4 5=GND 6=NetRGB1_KEY#32_4
KEY: designators end in _KEY#34; ports 1=KEY_SEG3 2=KEY_POS7 3=VCC3V3 4=NetRGB1_KEY#34_4 5=GND 6=NetRGB1_KEY#33_4
KEY: designators end in _KEY#35; ports 1=KEY_SEG3 2=KEY_POS8 3=VCC3V3 4=NetRGB1_KEY#35_4 5=GND 6=NetRGB1_KEY#34_4
KEY: designators end in _KEY#36; ports 1=KEY_SEG3 2=KEY_POS9 3=VCC3V3 4=NetRGB1_KEY#36_4 5=GND 6=NetRGB1_KEY#35_4
KEY: designators end in _KEY#37; ports 1=KEY_SEG3 2=KEY_POS10 3=VCC3V3 4=NetRGB1_KEY#37_4 5=GND 6=NetRGB1_KEY#36_4
KEY: designators end in _KEY#38; ports 1=KEY_SEG3 2=KEY_POS11 3=VCC3V3 4=NetRGB1_KEY#38_4 5=GND 6=NetRGB1_KEY#37_4
KEY: designators end in _KEY#39; ports 1=KEY_SEG3 2=KEY_POS12 3=VCC3V3 4=NetRGB1_KEY#39_4 5=GND 6=NetRGB1_KEY#38_4
KEY: designators end in _KEY#40; ports 1=KEY_SEG3 2=KEY_POS13 3=VCC3V3 4=NetRGB1_KEY#40_4 5=GND 6=NetRGB1_KEY#39_4
KEY: designators end in _KEY#41; ports 1=KEY_SEG3 2=KEY_POS14 3=VCC3V3 4=NET_TO2 5=GND 6=NetRGB1_KEY#40_4
KEY: designators end in _KEY#42; ports 1=KEY_SEG4 2=KEY_POS1 3=VCC3V3 4=NetRGB1_KEY#42_4 5=GND 6=NET_TO2
KEY: designators end in _KEY#43; ports 1=KEY_SEG4 2=KEY_POS2 3=VCC3V3 4=NetRGB1_KEY#43_4 5=GND 6=NetRGB1_KEY#42_4
KEY: designators end in _KEY#44; ports 1=KEY_SEG4 2=KEY_POS3 3=VCC3V3 4=NetRGB1_KEY#44_4 5=GND 6=NetRGB1_KEY#43_4
KEY: designators end in _KEY#45; ports 1=KEY_SEG4 2=KEY_POS4 3=VCC3V3 4=NetRGB1_KEY#45_4 5=GND 6=NetRGB1_KEY#44_4
KEY: designators end in _KEY#46; ports 1=KEY_SEG4 2=KEY_POS5 3=VCC3V3 4=NetRGB1_KEY#46_4 5=GND 6=NetRGB1_KEY#45_4
KEY: designators end in _KEY#47; ports 1=KEY_SEG4 2=KEY_POS6 3=VCC3V3 4=NetRGB1_KEY#47_4 5=GND 6=NetRGB1_KEY#46_4
KEY: designators end in _KEY#48; ports 1=KEY_SEG4 2=KEY_POS7 3=VCC3V3 4=NetRGB1_KEY#48_4 5=GND 6=NetRGB1_KEY#47_4
KEY: designators end in _KEY#49; ports 1=KEY_SEG4 2=KEY_POS8 3=VCC3V3 4=NetRGB1_KEY#49_4 5=GND 6=NetRGB1_KEY#48_4
KEY: designators end in _KEY#50; ports 1=KEY_SEG4 2=KEY_POS9 3=VCC3V3 4=NetRGB1_KEY#50_4 5=GND 6=NetRGB1_KEY#49_4
KEY: designators end in _KEY#51; ports 1=KEY_SEG4 2=KEY_POS10 3=VCC3V3 4=NetRGB1_KEY#51_4 5=GND 6=NetRGB1_KEY#50_4
KEY: designators end in _KEY#52; ports 1=KEY_SEG4 2=KEY_POS11 3=VCC3V3 4=NetRGB1_KEY#52_4 5=GND 6=NetRGB1_KEY#51_4
KEY: designators end in _KEY#53; ports 1=KEY_SEG4 2=KEY_POS12 3=VCC3V3 4=NetRGB1_KEY#53_4 5=GND 6=NetRGB1_KEY#52_4
KEY: designators end in _KEY#54; ports 1=KEY_SEG4 2=KEY_POS13 3=VCC3V3 4=NetRGB1_KEY#54_4 5=GND 6=NetRGB1_KEY#53_4
KEY: designators end in _KEY#55; ports 1=KEY_SEG4 2=KEY_POS14 3=VCC3V3 4=NetR2_1 5=GND 6=NetRGB1_KEY#54_4
KEY: designators end in _KEY#56; ports 1=KEY_SEG5 2=KEY_POS1 3=VCC3V3 4=NetRGB1_KEY#56_4 5=GND 6=WS2812_CTR3
KEY: designators end in _KEY#57; ports 1=KEY_SEG5 2=KEY_POS2 3=VCC3V3 4=NetRGB1_KEY#57_4 5=GND 6=NetRGB1_KEY#56_4
KEY: designators end in _KEY#58; ports 1=KEY_SEG5 2=KEY_POS3 3=VCC3V3 4=NetRGB1_KEY#58_4 5=GND 6=NetRGB1_KEY#57_4
KEY: designators end in _KEY#59; ports 1=KEY_SEG5 2=KEY_POS4 3=VCC3V3 4=NetRGB1_KEY#59_4 5=GND 6=NetRGB1_KEY#58_4
KEY: designators end in _KEY#60; ports 1=KEY_SEG5 2=KEY_POS5 3=VCC3V3 4=NetRGB1_KEY#60_4 5=GND 6=NetRGB1_KEY#59_4
KEY: designators end in _KEY#61; ports 1=KEY_SEG5 2=KEY_POS6 3=VCC3V3 4=NetRGB1_KEY#61_4 5=GND 6=NetRGB1_KEY#60_4
KEY: designators end in _KEY#62; ports 1=KEY_SEG5 2=KEY_POS7 3=VCC3V3 4=NetRGB1_KEY#62_4 5=GND 6=NetRGB1_KEY#61_4
KEY: designators end in _KEY#63; ports 1=KEY_SEG5 2=KEY_POS8 3=VCC3V3 4=NetRGB1_KEY#63_4 5=GND 6=NetRGB1_KEY#62_4
KEY: designators end in _KEY#64; ports 1=KEY_SEG5 2=KEY_POS9 3=VCC3V3 4=NetRGB1_KEY#64_4 5=GND 6=NetRGB1_KEY#63_4
KEY: designators end in _KEY#65; ports 1=KEY_SEG5 2=KEY_POS10 3=VCC3V3 4=NetRGB1_KEY#65_4 5=GND 6=NetRGB1_KEY#64_4
KEY: designators end in _KEY#66; ports 1=KEY_SEG5 2=KEY_POS11 3=VCC3V3 4=NetRGB1_KEY#66_4 5=GND 6=NetRGB1_KEY#65_4
KEY: designators end in _KEY#67; ports 1=KEY_SEG5 2=KEY_POS12 3=VCC3V3 4=NetRGB1_KEY#67_4 5=GND 6=NetRGB1_KEY#66_4
KEY: designators end in _KEY#68; ports 1=KEY_SEG5 2=KEY_POS13 3=VCC3V3 4=NET_TO3 5=GND 6=NetRGB1_KEY#67_4
KEY: designators end in _KEY#69; ports 1=KEY_SEG6 2=KEY_POS1 3=VCC3V3 4=NetRGB1_KEY#69_4 5=GND 6=NET_TO3
KEY: designators end in _KEY#70; ports 1=KEY_SEG6 2=KEY_POS2 3=VCC3V3 4=NetRGB1_KEY#70_4 5=GND 6=NetRGB1_KEY#69_4
KEY: designators end in _KEY#71; ports 1=KEY_SEG6 2=KEY_POS3 3=VCC3V3 4=NetRGB1_KEY#71_4 5=GND 6=NetRGB1_KEY#70_4
KEY: designators end in _KEY#72; ports 1=KEY_SEG6 2=KEY_POS4 3=VCC3V3 4=NetRGB1_KEY#72_4 5=GND 6=NetRGB1_KEY#71_4
KEY: designators end in _KEY#73; ports 1=KEY_SEG6 2=KEY_POS5 3=VCC3V3 4=NetRGB1_KEY#73_4 5=GND 6=NetRGB1_KEY#72_4
KEY: designators end in _KEY#74; ports 1=KEY_SEG6 2=KEY_POS6 3=VCC3V3 4=NetRGB1_KEY#74_4 5=GND 6=NetRGB1_KEY#73_4
KEY: designators end in _KEY#75; ports 1=KEY_SEG6 2=KEY_POS7 3=VCC3V3 4=NetRGB1_KEY#75_4 5=GND 6=NetRGB1_KEY#74_4
KEY: designators end in _KEY#76; ports 1=KEY_SEG6 2=KEY_POS8 3=VCC3V3 4=NetRGB1_KEY#76_4 5=GND 6=NetRGB1_KEY#75_4
KEY: designators end in _KEY#77; ports 1=KEY_SEG6 2=KEY_POS9 3=VCC3V3 4=NetRGB1_KEY#77_4 5=GND 6=NetRGB1_KEY#76_4
KEY: designators end in _KEY#78; ports 1=KEY_SEG6 2=KEY_POS10 3=VCC3V3 4=NetRGB1_KEY#78_4 5=GND 6=NetRGB1_KEY#77_4
KEY: designators end in _KEY#79; ports 1=KEY_SEG6 2=KEY_POS11 3=VCC3V3 4=NetRGB1_KEY#79_4 5=GND 6=NetRGB1_KEY#78_4
KEY: designators end in _KEY#80; ports 1=KEY_SEG6 2=KEY_POS12 3=VCC3V3 4=NetR3_1 5=GND 6=NetRGB1_KEY#79_4

### Library data of the parts
C1 = C: 贴片电容
D1 = 1N4148: 开关二极管
KEY_G1 = GATERON: with Fixation pins  1-Pole w/Diode
RGB1 = WS2812: with Fixation pins  1-Pole w/Diode

## Nets that join several sheets
VCC3V3: keyboard (5.33), KEY (C1_KEY#1.1 RGB1_KEY#1.3), KEY (C1_KEY#2.1 RGB1_KEY#2.3), KEY (C1_KEY#3.1 RGB1_KEY#3.3), KEY (C1_KEY#4.1 RGB1_KEY#4.3), KEY (C1_KEY#5.1 RGB1_KEY#5.3), KEY (C1_KEY#6.1 RGB1_KEY#6.3), KEY (C1_KEY#7.1 RGB1_KEY#7.3), KEY (C1_KEY#8.1 RGB1_KEY#8.3), KEY (C1_KEY#9.1 RGB1_KEY#9.3), KEY (C1_KEY#10.1 RGB1_KEY#10.3), KEY (C1_KEY#11.1 RGB1_KEY#11.3), KEY (C1_KEY#12.1 RGB1_KEY#12.3), KEY (C1_KEY#13.1 RGB1_KEY#13.3), KEY (C1_KEY#14.1 RGB1_KEY#14.3), KEY (C1_KEY#15.1 RGB1_KEY#15.3), KEY (C1_KEY#16.1 RGB1_KEY#16.3), KEY (C1_KEY#17.1 RGB1_KEY#17.3), KEY (C1_KEY#18.1 RGB1_KEY#18.3), KEY (C1_KEY#19.1 RGB1_KEY#19.3), KEY (C1_KEY#20.1 RGB1_KEY#20.3), KEY (C1_KEY#21.1 RGB1_KEY#21.3), KEY (C1_KEY#22.1 RGB1_KEY#22.3), KEY (C1_KEY#23.1 RGB1_KEY#23.3), KEY (C1_KEY#24.1 RGB1_KEY#24.3), KEY (C1_KEY#25.1 RGB1_KEY#25.3), KEY (C1_KEY#26.1 RGB1_KEY#26.3), KEY (C1_KEY#27.1 RGB1_KEY#27.3), KEY (C1_KEY#28.1 RGB1_KEY#28.3), KEY (C1_KEY#29.1 RGB1_KEY#29.3), KEY (C1_KEY#30.1 RGB1_KEY#30.3), KEY (C1_KEY#31.1 RGB1_KEY#31.3), KEY (C1_KEY#32.1 RGB1_KEY#32.3), KEY (C1_KEY#33.1 RGB1_KEY#33.3), KEY (C1_KEY#34.1 RGB1_KEY#34.3), KEY (C1_KEY#35.1 RGB1_KEY#35.3), KEY (C1_KEY#36.1 RGB1_KEY#36.3), KEY (C1_KEY#37.1 RGB1_KEY#37.3), KEY (C1_KEY#38.1 RGB1_KEY#38.3), KEY (C1_KEY#39.1 RGB1_KEY#39.3), KEY (C1_KEY#40.1 RGB1_KEY#40.3), KEY (C1_KEY#41.1 RGB1_KEY#41.3), KEY (C1_KEY#42.1 RGB1_KEY#42.3), KEY (C1_KEY#43.1 RGB1_KEY#43.3), KEY (C1_KEY#44.1 RGB1_KEY#44.3), KEY (C1_KEY#45.1 RGB1_KEY#45.3), KEY (C1_KEY#46.1 RGB1_KEY#46.3), KEY (C1_KEY#47.1 RGB1_KEY#47.3), KEY (C1_KEY#48.1 RGB1_KEY#48.3), KEY (C1_KEY#49.1 RGB1_KEY#49.3), KEY (C1_KEY#50.1 RGB1_KEY#50.3), KEY (C1_KEY#51.1 RGB1_KEY#51.3), KEY (C1_KEY#52.1 RGB1_KEY#52.3), KEY (C1_KEY#53.1 RGB1_KEY#53.3), KEY (C1_KEY#54.1 RGB1_KEY#54.3), KEY (C1_KEY#55.1 RGB1_KEY#55.3), KEY (C1_KEY#56.1 RGB1_KEY#56.3), KEY (C1_KEY#57.1 RGB1_KEY#57.3), KEY (C1_KEY#58.1 RGB1_KEY#58.3), KEY (C1_KEY#59.1 RGB1_KEY#59.3), KEY (C1_KEY#60.1 RGB1_KEY#60.3), KEY (C1_KEY#61.1 RGB1_KEY#61.3), KEY (C1_KEY#62.1 RGB1_KEY#62.3), KEY (C1_KEY#63.1 RGB1_KEY#63.3), KEY (C1_KEY#64.1 RGB1_KEY#64.3), KEY (C1_KEY#65.1 RGB1_KEY#65.3), KEY (C1_KEY#66.1 RGB1_KEY#66.3), KEY (C1_KEY#67.1 RGB1_KEY#67.3), KEY (C1_KEY#68.1 RGB1_KEY#68.3), KEY (C1_KEY#69.1 RGB1_KEY#69.3), KEY (C1_KEY#70.1 RGB1_KEY#70.3), KEY (C1_KEY#71.1 RGB1_KEY#71.3), KEY (C1_KEY#72.1 RGB1_KEY#72.3), KEY (C1_KEY#73.1 RGB1_KEY#73.3), KEY (C1_KEY#74.1 RGB1_KEY#74.3), KEY (C1_KEY#75.1 RGB1_KEY#75.3), KEY (C1_KEY#76.1 RGB1_KEY#76.3), KEY (C1_KEY#77.1 RGB1_KEY#77.3), KEY (C1_KEY#78.1 RGB1_KEY#78.3), KEY (C1_KEY#79.1 RGB1_KEY#79.3), KEY (C1_KEY#80.1 RGB1_KEY#80.3)
GND: keyboard (9 pins), KEY (C1_KEY#1.2 RGB1_KEY#1.5), KEY (C1_KEY#2.2 RGB1_KEY#2.5), KEY (C1_KEY#3.2 RGB1_KEY#3.5), KEY (C1_KEY#4.2 RGB1_KEY#4.5), KEY (C1_KEY#5.2 RGB1_KEY#5.5), KEY (C1_KEY#6.2 RGB1_KEY#6.5), KEY (C1_KEY#7.2 RGB1_KEY#7.5), KEY (C1_KEY#8.2 RGB1_KEY#8.5), KEY (C1_KEY#9.2 RGB1_KEY#9.5), KEY (C1_KEY#10.2 RGB1_KEY#10.5), KEY (C1_KEY#11.2 RGB1_KEY#11.5), KEY (C1_KEY#12.2 RGB1_KEY#12.5), KEY (C1_KEY#13.2 RGB1_KEY#13.5), KEY (C1_KEY#14.2 RGB1_KEY#14.5), KEY (C1_KEY#15.2 RGB1_KEY#15.5), KEY (C1_KEY#16.2 RGB1_KEY#16.5), KEY (C1_KEY#17.2 RGB1_KEY#17.5), KEY (C1_KEY#18.2 RGB1_KEY#18.5), KEY (C1_KEY#19.2 RGB1_KEY#19.5), KEY (C1_KEY#20.2 RGB1_KEY#20.5), KEY (C1_KEY#21.2 RGB1_KEY#21.5), KEY (C1_KEY#22.2 RGB1_KEY#22.5), KEY (C1_KEY#23.2 RGB1_KEY#23.5), KEY (C1_KEY#24.2 RGB1_KEY#24.5), KEY (C1_KEY#25.2 RGB1_KEY#25.5), KEY (C1_KEY#26.2 RGB1_KEY#26.5), KEY (C1_KEY#27.2 RGB1_KEY#27.5), KEY (C1_KEY#28.2 RGB1_KEY#28.5), KEY (C1_KEY#29.2 RGB1_KEY#29.5), KEY (C1_KEY#30.2 RGB1_KEY#30.5), KEY (C1_KEY#31.2 RGB1_KEY#31.5), KEY (C1_KEY#32.2 RGB1_KEY#32.5), KEY (C1_KEY#33.2 RGB1_KEY#33.5), KEY (C1_KEY#34.2 RGB1_KEY#34.5), KEY (C1_KEY#35.2 RGB1_KEY#35.5), KEY (C1_KEY#36.2 RGB1_KEY#36.5), KEY (C1_KEY#37.2 RGB1_KEY#37.5), KEY (C1_KEY#38.2 RGB1_KEY#38.5), KEY (C1_KEY#39.2 RGB1_KEY#39.5), KEY (C1_KEY#40.2 RGB1_KEY#40.5), KEY (C1_KEY#41.2 RGB1_KEY#41.5), KEY (C1_KEY#42.2 RGB1_KEY#42.5), KEY (C1_KEY#43.2 RGB1_KEY#43.5), KEY (C1_KEY#44.2 RGB1_KEY#44.5), KEY (C1_KEY#45.2 RGB1_KEY#45.5), KEY (C1_KEY#46.2 RGB1_KEY#46.5), KEY (C1_KEY#47.2 RGB1_KEY#47.5), KEY (C1_KEY#48.2 RGB1_KEY#48.5), KEY (C1_KEY#49.2 RGB1_KEY#49.5), KEY (C1_KEY#50.2 RGB1_KEY#50.5), KEY (C1_KEY#51.2 RGB1_KEY#51.5), KEY (C1_KEY#52.2 RGB1_KEY#52.5), KEY (C1_KEY#53.2 RGB1_KEY#53.5), KEY (C1_KEY#54.2 RGB1_KEY#54.5), KEY (C1_KEY#55.2 RGB1_KEY#55.5), KEY (C1_KEY#56.2 RGB1_KEY#56.5), KEY (C1_KEY#57.2 RGB1_KEY#57.5), KEY (C1_KEY#58.2 RGB1_KEY#58.5), KEY (C1_KEY#59.2 RGB1_KEY#59.5), KEY (C1_KEY#60.2 RGB1_KEY#60.5), KEY (C1_KEY#61.2 RGB1_KEY#61.5), KEY (C1_KEY#62.2 RGB1_KEY#62.5), KEY (C1_KEY#63.2 RGB1_KEY#63.5), KEY (C1_KEY#64.2 RGB1_KEY#64.5), KEY (C1_KEY#65.2 RGB1_KEY#65.5), KEY (C1_KEY#66.2 RGB1_KEY#66.5), KEY (C1_KEY#67.2 RGB1_KEY#67.5), KEY (C1_KEY#68.2 RGB1_KEY#68.5), KEY (C1_KEY#69.2 RGB1_KEY#69.5), KEY (C1_KEY#70.2 RGB1_KEY#70.5), KEY (C1_KEY#71.2 RGB1_KEY#71.5), KEY (C1_KEY#72.2 RGB1_KEY#72.5), KEY (C1_KEY#73.2 RGB1_KEY#73.5), KEY (C1_KEY#74.2 RGB1_KEY#74.5), KEY (C1_KEY#75.2 RGB1_KEY#75.5), KEY (C1_KEY#76.2 RGB1_KEY#76.5), KEY (C1_KEY#77.2 RGB1_KEY#77.5), KEY (C1_KEY#78.2 RGB1_KEY#78.5), KEY (C1_KEY#79.2 RGB1_KEY#79.5), KEY (C1_KEY#80.2 RGB1_KEY#80.5)
KEY_POS1: keyboard (5.11), KEY (D1_KEY#3.2), KEY (D1_KEY#14.2), KEY (D1_KEY#28.2), KEY (D1_KEY#42.2), KEY (D1_KEY#56.2), KEY (D1_KEY#69.2)
KEY_POS2: keyboard (5.12), KEY (D1_KEY#1.2), KEY (D1_KEY#15.2), KEY (D1_KEY#29.2), KEY (D1_KEY#43.2), KEY (D1_KEY#57.2), KEY (D1_KEY#70.2)
KEY_POS3: keyboard (5.13), KEY (D1_KEY#2.2), KEY (D1_KEY#16.2), KEY (D1_KEY#30.2), KEY (D1_KEY#44.2), KEY (D1_KEY#58.2), KEY (D1_KEY#71.2)
KEY_POS4: keyboard (5.14), KEY (D1_KEY#4.2), KEY (D1_KEY#17.2), KEY (D1_KEY#31.2), KEY (D1_KEY#45.2), KEY (D1_KEY#59.2), KEY (D1_KEY#72.2)
KEY_POS5: keyboard (5.15), KEY (D1_KEY#5.2), KEY (D1_KEY#18.2), KEY (D1_KEY#32.2), KEY (D1_KEY#46.2), KEY (D1_KEY#60.2), KEY (D1_KEY#73.2)
KEY_POS6: keyboard (5.16), KEY (D1_KEY#6.2), KEY (D1_KEY#19.2), KEY (D1_KEY#33.2), KEY (D1_KEY#47.2), KEY (D1_KEY#61.2), KEY (D1_KEY#74.2)
KEY_POS7: keyboard (5.17), KEY (D1_KEY#7.2), KEY (D1_KEY#20.2), KEY (D1_KEY#34.2), KEY (D1_KEY#48.2), KEY (D1_KEY#62.2), KEY (D1_KEY#75.2)
KEY_POS8: keyboard (5.18), KEY (D1_KEY#8.2), KEY (D1_KEY#21.2), KEY (D1_KEY#35.2), KEY (D1_KEY#49.2), KEY (D1_KEY#63.2), KEY (D1_KEY#76.2)
KEY_POS9: keyboard (5.19), KEY (D1_KEY#9.2), KEY (D1_KEY#22.2), KEY (D1_KEY#36.2), KEY (D1_KEY#50.2), KEY (D1_KEY#64.2), KEY (D1_KEY#77.2)
KEY_POS10: keyboard (5.20), KEY (D1_KEY#10.2), KEY (D1_KEY#23.2), KEY (D1_KEY#37.2), KEY (D1_KEY#51.2), KEY (D1_KEY#65.2), KEY (D1_KEY#78.2)
KEY_POS11: keyboard (5.21), KEY (D1_KEY#11.2), KEY (D1_KEY#24.2), KEY (D1_KEY#38.2), KEY (D1_KEY#52.2), KEY (D1_KEY#66.2), KEY (D1_KEY#79.2)
KEY_POS12: keyboard (5.22), KEY (D1_KEY#12.2), KEY (D1_KEY#25.2), KEY (D1_KEY#39.2), KEY (D1_KEY#53.2), KEY (D1_KEY#67.2), KEY (D1_KEY#80.2)
KEY_POS13: keyboard (5.23), KEY (D1_KEY#13.2), KEY (D1_KEY#26.2), KEY (D1_KEY#40.2), KEY (D1_KEY#54.2), KEY (D1_KEY#68.2)
KEY_POS14: keyboard (5.24), KEY (D1_KEY#27.2), KEY (D1_KEY#41.2), KEY (D1_KEY#55.2)
KEY_SEG1: keyboard (5.31), KEY (KEY_G1_KEY#1.1), KEY (KEY_G1_KEY#2.1), KEY (KEY_G1_KEY#3.1), KEY (KEY_G1_KEY#4.1), KEY (KEY_G1_KEY#5.1), KEY (KEY_G1_KEY#6.1), KEY (KEY_G1_KEY#7.1), KEY (KEY_G1_KEY#8.1), KEY (KEY_G1_KEY#9.1), KEY (KEY_G1_KEY#10.1), KEY (KEY_G1_KEY#11.1), KEY (KEY_G1_KEY#12.1), KEY (KEY_G1_KEY#13.1)
KEY_SEG2: keyboard (5.30), KEY (KEY_G1_KEY#14.1), KEY (KEY_G1_KEY#15.1), KEY (KEY_G1_KEY#16.1), KEY (KEY_G1_KEY#17.1), KEY (KEY_G1_KEY#18.1), KEY (KEY_G1_KEY#19.1), KEY (KEY_G1_KEY#20.1), KEY (KEY_G1_KEY#21.1), KEY (KEY_G1_KEY#22.1), KEY (KEY_G1_KEY#23.1), KEY (KEY_G1_KEY#24.1), KEY (KEY_G1_KEY#25.1), KEY (KEY_G1_KEY#26.1), KEY (KEY_G1_KEY#27.1)
KEY_SEG3: keyboard (5.29), KEY (KEY_G1_KEY#28.1), KEY (KEY_G1_KEY#29.1), KEY (KEY_G1_KEY#30.1), KEY (KEY_G1_KEY#31.1), KEY (KEY_G1_KEY#32.1), KEY (KEY_G1_KEY#33.1), KEY (KEY_G1_KEY#34.1), KEY (KEY_G1_KEY#35.1), KEY (KEY_G1_KEY#36.1), KEY (KEY_G1_KEY#37.1), KEY (KEY_G1_KEY#38.1), KEY (KEY_G1_KEY#39.1), KEY (KEY_G1_KEY#40.1), KEY (KEY_G1_KEY#41.1)
KEY_SEG4: keyboard (5.28), KEY (KEY_G1_KEY#42.1), KEY (KEY_G1_KEY#43.1), KEY (KEY_G1_KEY#44.1), KEY (KEY_G1_KEY#45.1), KEY (KEY_G1_KEY#46.1), KEY (KEY_G1_KEY#47.1), KEY (KEY_G1_KEY#48.1), KEY (KEY_G1_KEY#49.1), KEY (KEY_G1_KEY#50.1), KEY (KEY_G1_KEY#51.1), KEY (KEY_G1_KEY#52.1), KEY (KEY_G1_KEY#53.1), KEY (KEY_G1_KEY#54.1), KEY (KEY_G1_KEY#55.1)
KEY_SEG5: keyboard (5.27), KEY (KEY_G1_KEY#56.1), KEY (KEY_G1_KEY#57.1), KEY (KEY_G1_KEY#58.1), KEY (KEY_G1_KEY#59.1), KEY (KEY_G1_KEY#60.1), KEY (KEY_G1_KEY#61.1), KEY (KEY_G1_KEY#62.1), KEY (KEY_G1_KEY#63.1), KEY (KEY_G1_KEY#64.1), KEY (KEY_G1_KEY#65.1), KEY (KEY_G1_KEY#66.1), KEY (KEY_G1_KEY#67.1), KEY (KEY_G1_KEY#68.1)
KEY_SEG6: keyboard (5.26), KEY (KEY_G1_KEY#69.1), KEY (KEY_G1_KEY#70.1), KEY (KEY_G1_KEY#71.1), KEY (KEY_G1_KEY#72.1), KEY (KEY_G1_KEY#73.1), KEY (KEY_G1_KEY#74.1), KEY (KEY_G1_KEY#75.1), KEY (KEY_G1_KEY#76.1), KEY (KEY_G1_KEY#77.1), KEY (KEY_G1_KEY#78.1), KEY (KEY_G1_KEY#79.1), KEY (KEY_G1_KEY#80.1)
NET_TO1: KEY (RGB1_KEY#13.4), KEY (RGB1_KEY#14.6)
NET_TO2: KEY (RGB1_KEY#41.4), KEY (RGB1_KEY#42.6)
NET_TO3: KEY (RGB1_KEY#68.4), KEY (RGB1_KEY#69.6)
NetR1_1: keyboard (R1.1), KEY (RGB1_KEY#27.4)
NetR2_1: keyboard (R2.1), KEY (RGB1_KEY#55.4)
NetR3_1: keyboard (R3.1), KEY (RGB1_KEY#80.4)
NetRGB1_KEY#1_4: KEY (RGB1_KEY#1.4), KEY (RGB1_KEY#2.6)
NetRGB1_KEY#1_6: KEY (RGB1_KEY#1.6), KEY (RGB1_KEY#3.4)
NetRGB1_KEY#2_4: KEY (RGB1_KEY#2.4), KEY (RGB1_KEY#4.6)
NetRGB1_KEY#4_4: KEY (RGB1_KEY#4.4), KEY (RGB1_KEY#5.6)
NetRGB1_KEY#5_4: KEY (RGB1_KEY#5.4), KEY (RGB1_KEY#6.6)
NetRGB1_KEY#6_4: KEY (RGB1_KEY#6.4), KEY (RGB1_KEY#7.6)
NetRGB1_KEY#7_4: KEY (RGB1_KEY#7.4), KEY (RGB1_KEY#8.6)
NetRGB1_KEY#8_4: KEY (RGB1_KEY#8.4), KEY (RGB1_KEY#9.6)
NetRGB1_KEY#9_4: KEY (RGB1_KEY#9.4), KEY (RGB1_KEY#10.6)
NetRGB1_KEY#10_4: KEY (RGB1_KEY#10.4), KEY (RGB1_KEY#11.6)
NetRGB1_KEY#11_4: KEY (RGB1_KEY#11.4), KEY (RGB1_KEY#12.6)
NetRGB1_KEY#12_4: KEY (RGB1_KEY#12.4), KEY (RGB1_KEY#13.6)
NetRGB1_KEY#14_4: KEY (RGB1_KEY#14.4), KEY (RGB1_KEY#15.6)
NetRGB1_KEY#15_4: KEY (RGB1_KEY#15.4), KEY (RGB1_KEY#16.6)
NetRGB1_KEY#16_4: KEY (RGB1_KEY#16.4), KEY (RGB1_KEY#17.6)
NetRGB1_KEY#17_4: KEY (RGB1_KEY#17.4), KEY (RGB1_KEY#18.6)
NetRGB1_KEY#18_4: KEY (RGB1_KEY#18.4), KEY (RGB1_KEY#19.6)
NetRGB1_KEY#19_4: KEY (RGB1_KEY#19.4), KEY (RGB1_KEY#20.6)
NetRGB1_KEY#20_4: KEY (RGB1_KEY#20.4), KEY (RGB1_KEY#21.6)
NetRGB1_KEY#21_4: KEY (RGB1_KEY#21.4), KEY (RGB1_KEY#22.6)
NetRGB1_KEY#22_4: KEY (RGB1_KEY#22.4), KEY (RGB1_KEY#23.6)
NetRGB1_KEY#23_4: KEY (RGB1_KEY#23.4), KEY (RGB1_KEY#24.6)
NetRGB1_KEY#24_4: KEY (RGB1_KEY#24.4), KEY (RGB1_KEY#25.6)
NetRGB1_KEY#25_4: KEY (RGB1_KEY#25.4), KEY (RGB1_KEY#26.6)
NetRGB1_KEY#26_4: KEY (RGB1_KEY#26.4), KEY (RGB1_KEY#27.6)
NetRGB1_KEY#28_4: KEY (RGB1_KEY#28.4), KEY (RGB1_KEY#29.6)
NetRGB1_KEY#29_4: KEY (RGB1_KEY#29.4), KEY (RGB1_KEY#30.6)
NetRGB1_KEY#30_4: KEY (RGB1_KEY#30.4), KEY (RGB1_KEY#31.6)
NetRGB1_KEY#31_4: KEY (RGB1_KEY#31.4), KEY (RGB1_KEY#32.6)
NetRGB1_KEY#32_4: KEY (RGB1_KEY#32.4), KEY (RGB1_KEY#33.6)
NetRGB1_KEY#33_4: KEY (RGB1_KEY#33.4), KEY (RGB1_KEY#34.6)
NetRGB1_KEY#34_4: KEY (RGB1_KEY#34.4), KEY (RGB1_KEY#35.6)
NetRGB1_KEY#35_4: KEY (RGB1_KEY#35.4), KEY (RGB1_KEY#36.6)
NetRGB1_KEY#36_4: KEY (RGB1_KEY#36.4), KEY (RGB1_KEY#37.6)
NetRGB1_KEY#37_4: KEY (RGB1_KEY#37.4), KEY (RGB1_KEY#38.6)
NetRGB1_KEY#38_4: KEY (RGB1_KEY#38.4), KEY (RGB1_KEY#39.6)
NetRGB1_KEY#39_4: KEY (RGB1_KEY#39.4), KEY (RGB1_KEY#40.6)
NetRGB1_KEY#40_4: KEY (RGB1_KEY#40.4), KEY (RGB1_KEY#41.6)
NetRGB1_KEY#42_4: KEY (RGB1_KEY#42.4), KEY (RGB1_KEY#43.6)
NetRGB1_KEY#43_4: KEY (RGB1_KEY#43.4), KEY (RGB1_KEY#44.6)
NetRGB1_KEY#44_4: KEY (RGB1_KEY#44.4), KEY (RGB1_KEY#45.6)
NetRGB1_KEY#45_4: KEY (RGB1_KEY#45.4), KEY (RGB1_KEY#46.6)
NetRGB1_KEY#46_4: KEY (RGB1_KEY#46.4), KEY (RGB1_KEY#47.6)
NetRGB1_KEY#47_4: KEY (RGB1_KEY#47.4), KEY (RGB1_KEY#48.6)
NetRGB1_KEY#48_4: KEY (RGB1_KEY#48.4), KEY (RGB1_KEY#49.6)
NetRGB1_KEY#49_4: KEY (RGB1_KEY#49.4), KEY (RGB1_KEY#50.6)
NetRGB1_KEY#50_4: KEY (RGB1_KEY#50.4), KEY (RGB1_KEY#51.6)
NetRGB1_KEY#51_4: KEY (RGB1_KEY#51.4), KEY (RGB1_KEY#52.6)
NetRGB1_KEY#52_4: KEY (RGB1_KEY#52.4), KEY (RGB1_KEY#53.6)
NetRGB1_KEY#53_4: KEY (RGB1_KEY#53.4), KEY (RGB1_KEY#54.6)
NetRGB1_KEY#54_4: KEY (RGB1_KEY#54.4), KEY (RGB1_KEY#55.6)
NetRGB1_KEY#56_4: KEY (RGB1_KEY#56.4), KEY (RGB1_KEY#57.6)
NetRGB1_KEY#57_4: KEY (RGB1_KEY#57.4), KEY (RGB1_KEY#58.6)
NetRGB1_KEY#58_4: KEY (RGB1_KEY#58.4), KEY (RGB1_KEY#59.6)
NetRGB1_KEY#59_4: KEY (RGB1_KEY#59.4), KEY (RGB1_KEY#60.6)
NetRGB1_KEY#60_4: KEY (RGB1_KEY#60.4), KEY (RGB1_KEY#61.6)
NetRGB1_KEY#61_4: KEY (RGB1_KEY#61.4), KEY (RGB1_KEY#62.6)
NetRGB1_KEY#62_4: KEY (RGB1_KEY#62.4), KEY (RGB1_KEY#63.6)
NetRGB1_KEY#63_4: KEY (RGB1_KEY#63.4), KEY (RGB1_KEY#64.6)
NetRGB1_KEY#64_4: KEY (RGB1_KEY#64.4), KEY (RGB1_KEY#65.6)
NetRGB1_KEY#65_4: KEY (RGB1_KEY#65.4), KEY (RGB1_KEY#66.6)
NetRGB1_KEY#66_4: KEY (RGB1_KEY#66.4), KEY (RGB1_KEY#67.6)
NetRGB1_KEY#67_4: KEY (RGB1_KEY#67.4), KEY (RGB1_KEY#68.6)
NetRGB1_KEY#69_4: KEY (RGB1_KEY#69.4), KEY (RGB1_KEY#70.6)
NetRGB1_KEY#70_4: KEY (RGB1_KEY#70.4), KEY (RGB1_KEY#71.6)
NetRGB1_KEY#71_4: KEY (RGB1_KEY#71.4), KEY (RGB1_KEY#72.6)
NetRGB1_KEY#72_4: KEY (RGB1_KEY#72.4), KEY (RGB1_KEY#73.6)
NetRGB1_KEY#73_4: KEY (RGB1_KEY#73.4), KEY (RGB1_KEY#74.6)
NetRGB1_KEY#74_4: KEY (RGB1_KEY#74.4), KEY (RGB1_KEY#75.6)
NetRGB1_KEY#75_4: KEY (RGB1_KEY#75.4), KEY (RGB1_KEY#76.6)
NetRGB1_KEY#76_4: KEY (RGB1_KEY#76.4), KEY (RGB1_KEY#77.6)
NetRGB1_KEY#77_4: KEY (RGB1_KEY#77.4), KEY (RGB1_KEY#78.6)
NetRGB1_KEY#78_4: KEY (RGB1_KEY#78.4), KEY (RGB1_KEY#79.6)
NetRGB1_KEY#79_4: KEY (RGB1_KEY#79.4), KEY (RGB1_KEY#80.6)
WS2812_CTR1: keyboard (5.9), KEY (RGB1_KEY#3.6)
WS2812_CTR2: keyboard (5.8), KEY (RGB1_KEY#28.6)
WS2812_CTR3: keyboard (5.7), KEY (RGB1_KEY#56.6)